# Altium project External_Camera_HAT.PrjPcb
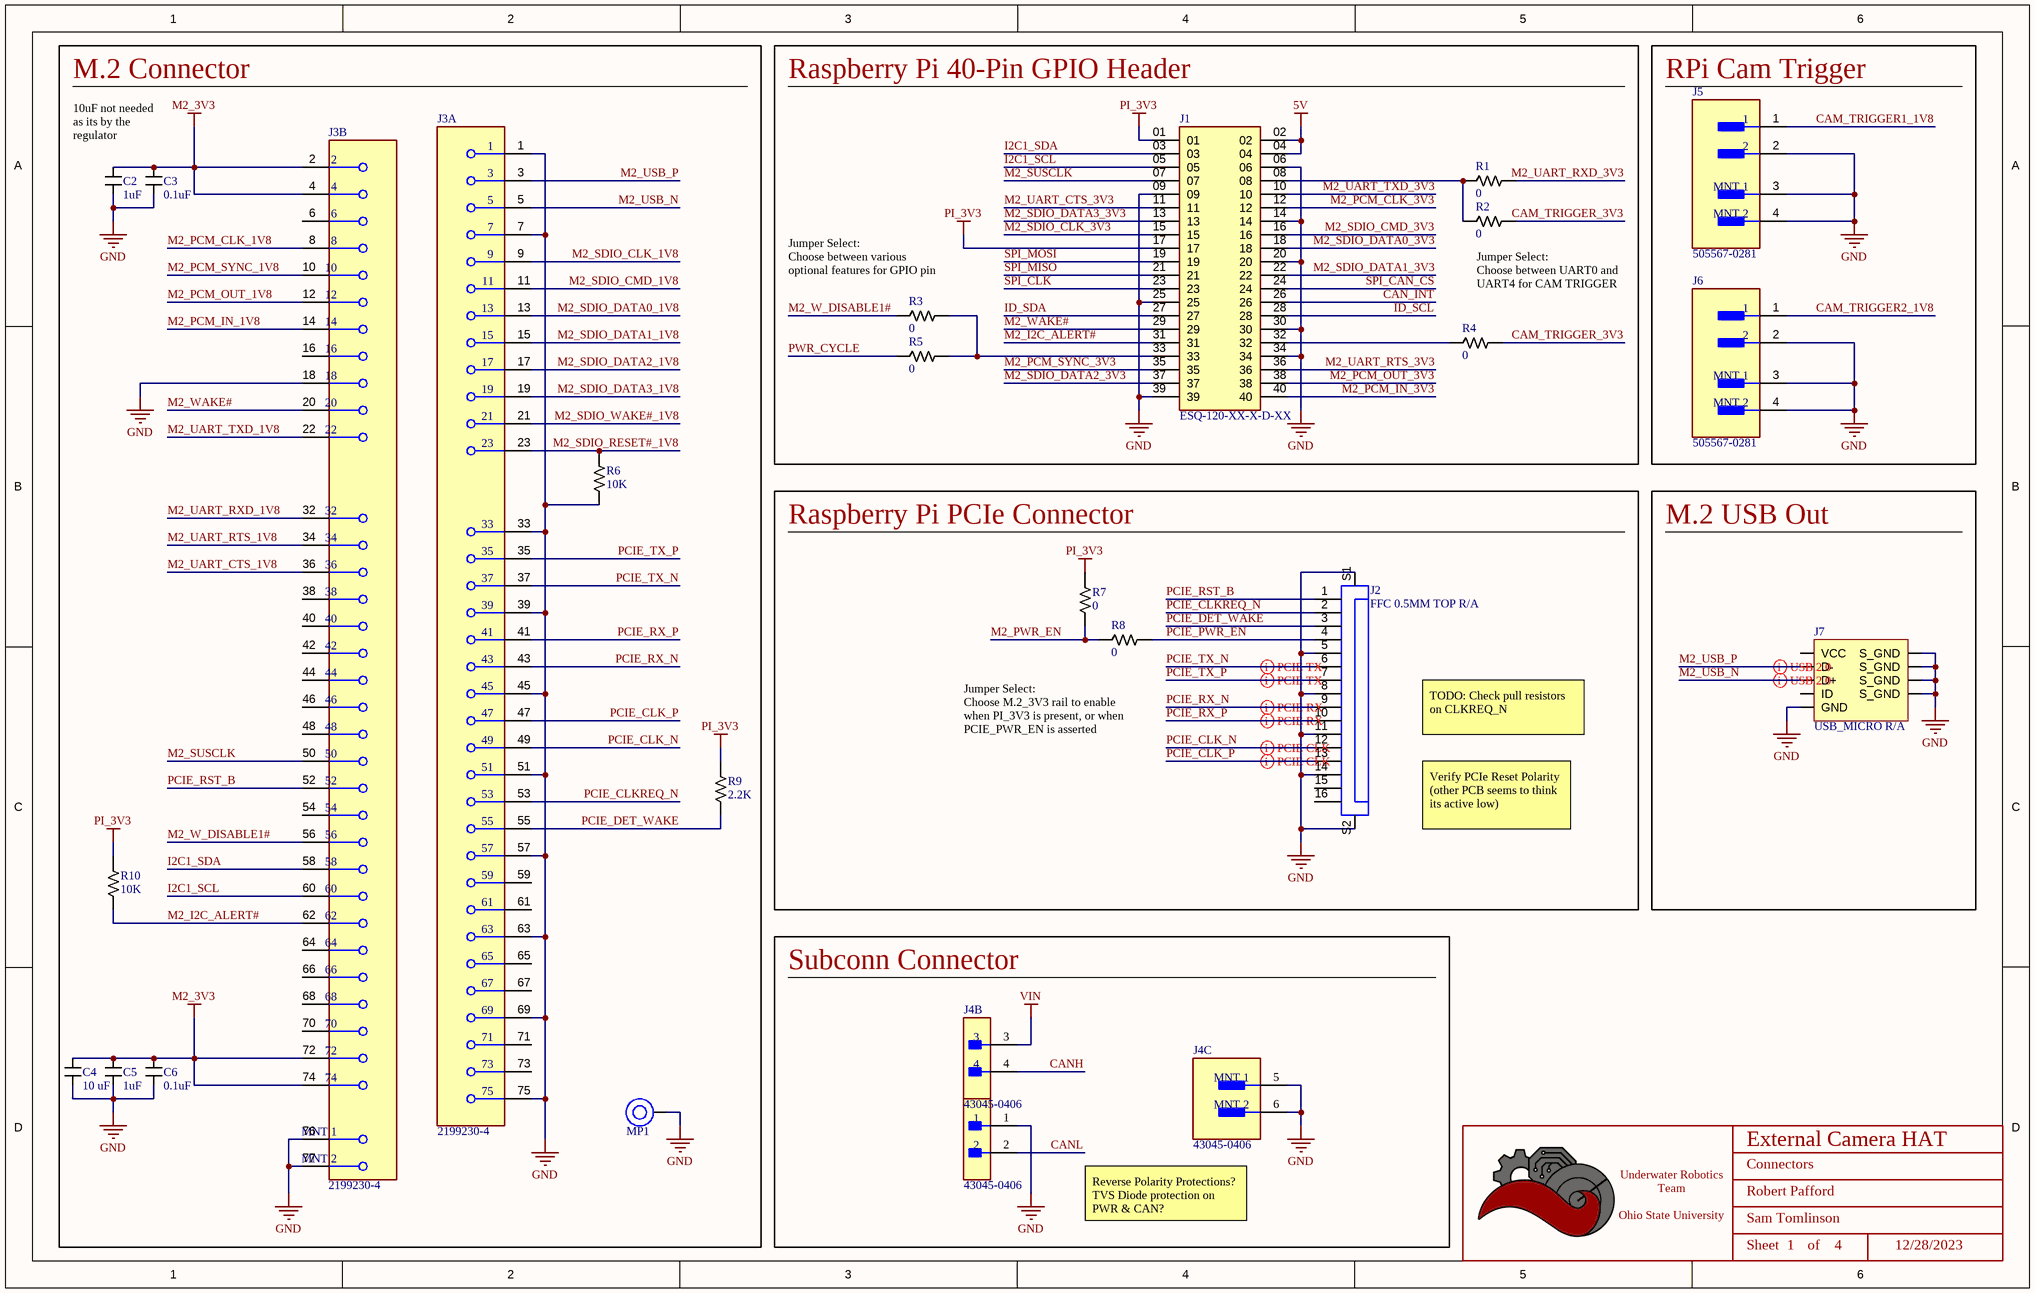
[diagram p0: External_Camera_HAT_Connectors.SchDoc]
BoardRevision: 1.0; DateOfDesignReview: XX/XX/XXXX; ProjectTitle: External Camera HAT; TeamLead: Sam Tomlinson
4 sheets, 127 parts. Net scope: global (net labels, ports and power ports of the same name join across sheets).
Board file: External_Camera_HAT.PcbDoc
Sheets:
  External_Camera_HAT_Connectors.SchDoc
  External_Camera_HAT_Regulators.SchDoc
  External_Camera_HAT_Peripherals.SchDoc
  External_Camera_HAT_LvlShifters.SchDoc

## Sheet External_Camera_HAT_Connectors.SchDoc: Connectors
size B; Date: 12/28/2023; Author: Robert Pafford; Organization: ORGANIZATION; Address1: ADDRESS 1; Address2: ADDRESS 2; Address3: ADDRESS 3; Address4: ADDRESS 4; Revision: -; SheetNumber: 1; SheetTotal: 4; ENG_APP_DATE: --/--/--; DSN_APP_DATE: --/--/--; CHK_APP_DATE: --/--/--

### Parts
(Parts that share a designator on the sheet are numbered #1, #2 ... from top to bottom, then left to right.)
*#1  Title_Block  [LOGO]  (value not drawn)  (graphical)
C2  value 1uF  [CAPACITOR_0402]  (hidden comment: 1uF Ceramic 16V)
C3  value 0.1uF  [CAPACITOR_0402]  (hidden comment: 100nF Ceramic 25V)
C4  Value (uF): 10 uF  [CAPACITOR_0603]  (hidden comment: 10uF Ceramic 6.3V)
C5  value 1uF  [CAPACITOR_0402]  (hidden comment: 1uF Ceramic 16V)
C6  value 0.1uF  [CAPACITOR_0402]  (hidden comment: 100nF Ceramic 25V)
J1  ESQ-120-XX-X-D-XX  [SAMTEC_ESQ-120-XX-X-D-XX]
J2  FFC 0.5MM TOP R/A  [FH12A-16S-0.5SH(55)]
J3  2199230-4  [FP-2199230-4-MFG]  (parts A,B of 2)
J4  43045-0406  [FP-43045-0406-MFG]  (parts A,B,C of 3)
J5  505567-0281  [FP-505567-0281-MFG]
J6  505567-0281  [FP-505567-0281-MFG]
J7  USB_MICRO R/A  [CONN_MINIUSB]
MP1  M3 x 2.5mm  [78614025360]  (value not drawn)
R1  Value  (Ohms): 0  [RESISTOR_0402]  (hidden comment: 0 Ohm 1% 1/16W)
R2  Value  (Ohms): 0  [RESISTOR_0402]  (hidden comment: 0 Ohm 1% 1/16W)
R3  Value  (Ohms): 0  [RESISTOR_0402]  (hidden comment: 0 Ohm 1% 1/16W)
R4  Value  (Ohms): 0  [RESISTOR_0402]  (hidden comment: 0 Ohm 1% 1/16W)
R5  Value  (Ohms): 0  [RESISTOR_0402]  (hidden comment: 0 Ohm 1% 1/16W)
R6  Value  (Ohms): 10K  [RESISTOR_0402]  (hidden comment: 10k Ohm 1% 1/16W)
R7  Value  (Ohms): 0  [RESISTOR_0402]  (hidden comment: 0 Ohm 1% 1/16W)
R8  Value  (Ohms): 0  [RESISTOR_0402]  (hidden comment: 0 Ohm 1% 1/16W)
R9  Value  (Ohms): 2.2K  [RESISTOR_0402]  (hidden comment: 2.2k Ohm 1% 1/16W)
R10  Value  (Ohms): 10K  [RESISTOR_0402]  (hidden comment: 10k Ohm 1% 1/16W)

### Blocks framed on the sheet
M.2 Connector: C2-C6 J3 MP1 R6 R9 R10
Raspberry Pi 40-Pin GPIO Header: J1 R1-R5
RPi Cam Trigger: J5 J6
Raspberry Pi PCIe Connector: J2 R7 R8
M.2 USB Out: J7
Subconn Connector: J4

### Nets
5V: J1.02 J1.04
GND: C2.2 C3.2 C4.2 C5.2 C6.2 J1.06 J1.09 J1.14 J1.20 J1.25 J1.30 J1.34 J1.39 J2.5 J2.8 J2.11 J2.14 J2.S1 J2.S2 J3.1 J3.7 J3.18 J3.33 J3.39 J3.45 J3.51 J3.57 J3.63 J3.69 J3.75 J3.76(MNT_1) J3.77(MNT_2) J4.1 J4.5(MNT_1) J4.6(MNT_2) J5.2 J5.3(MNT_1) J5.4(MNT_2) J6.2 J6.3(MNT_1) J6.4(MNT_2) J7.5(GND) J7.6(S_GND) J7.7(S_GND) J7.8(S_GND) J7.9(S_GND) MP1.1 R6.2
M2_3V3: C2.1 C3.1 C4.1 C5.1 C6.1 J3.2 J3.4 J3.72 J3.74
PI_3V3: J1.01 J1.17 R7.1 R9.1 R10.1
VIN: J4.3
CAM_TRIGGER1_1V8: J5.1
CAM_TRIGGER2_1V8: J6.1
CAM_TRIGGER_3V3: R2.1 R4.1
CAN_INT: J1.26
CANH: J4.4
CANL: J4.2
I2C1_SCL: J1.05 J3.60
I2C1_SDA: J1.03 J3.58
ID_SCL: J1.28
ID_SDA: J1.27
M2_I2C_ALERT#: J1.31 J3.62 R10.2
M2_PCM_CLK_1V8: J3.8
M2_PCM_CLK_3V3: J1.12
M2_PCM_IN_1V8: J3.14
M2_PCM_IN_3V3: J1.40
M2_PCM_OUT_1V8: J3.12
M2_PCM_OUT_3V3: J1.38
M2_PCM_SYNC_1V8: J3.10
M2_PCM_SYNC_3V3: J1.35
M2_PWR_EN: R7.2 R8.2
M2_SDIO_CLK_1V8: J3.9
M2_SDIO_CLK_3V3: J1.15
M2_SDIO_CMD_1V8: J3.11
M2_SDIO_CMD_3V3: J1.16
M2_SDIO_DATA0_1V8: J3.13
M2_SDIO_DATA0_3V3: J1.18
M2_SDIO_DATA1_1V8: J3.15
M2_SDIO_DATA1_3V3: J1.22
M2_SDIO_DATA2_1V8: J3.17
M2_SDIO_DATA2_3V3: J1.37
M2_SDIO_DATA3_1V8: J3.19
M2_SDIO_DATA3_3V3: J1.13
M2_SDIO_RESET#_1V8: J3.23 R6.1
M2_SDIO_WAKE#_1V8: J3.21
M2_SUSCLK: J1.07 J3.50
M2_UART_CTS_1V8: J3.36
M2_UART_CTS_3V3: J1.11
M2_UART_RTS_1V8: J3.34
M2_UART_RTS_3V3: J1.36
M2_UART_RXD_1V8: J3.32
M2_UART_RXD_3V3: R1.1
M2_UART_TXD_1V8: J3.22
M2_UART_TXD_3V3: J1.10
M2_USB_N: J3.5 J7.3(D+)
M2_USB_P: J3.3 J7.2(D-)
M2_W_DISABLE1#: J3.56 R3.2
M2_WAKE#: J1.29 J3.20
PCIE_CLK_N: J2.12 J3.49
PCIE_CLK_P: J2.13 J3.47
PCIE_CLKREQ_N: J2.2 J3.53
PCIE_DET_WAKE: J2.3 J3.55 R9.2
PCIE_PWR_EN: J2.4 R8.1
PCIE_RST_B: J2.1 J3.52
PCIE_RX_N: J2.9 J3.43
PCIE_RX_P: J2.10 J3.41
PCIE_TX_N: J2.6 J3.37
PCIE_TX_P: J2.7 J3.35
PWR_CYCLE: R5.2
SPI_CAN_CS: J1.24
SPI_CLK: J1.23
SPI_MISO: J1.21
SPI_MOSI: J1.19
NetJ1_08: J1.08 R1.2 R2.2
NetJ1_32: J1.32 R4.2
NetJ1_33: J1.33 R3.1 R5.1

Not connected (* = marked no-connect by the designer): J2 15 16; J3 6 16 38 40 42 44 46 48 54 59 61 64 65 66 67 68 70 71 73; J7 1(VCC) 4(ID)

### Layout directives
differential pair; differential pair class USB 2.0: M2_USB_N, M2_USB_P
differential pair; differential pair class PCIe Gen 2: PCIE_CLK_N, PCIE_CLK_P, PCIE_RX_N, PCIE_RX_P, PCIE_TX_N, PCIE_TX_P

### Notes on the sheet
- 10uF not needed as its by the regulator
- (near R3) Jumper Select:
  Choose between various optional features for GPIO pin
- Jumper Select:
  Choose between UART0 and UART4 for CAM TRIGGER
- (near R8) Jumper Select:
  Choose M.2_3V3 rail to enable when PI_3V3 is present, or when PCIE_PWR_EN is asserted
- TODO: Check pull resistors on CLKREQ_N
- Verify PCIe Reset Polarity (other PCB seems to think its active low)
- Reverse Polarity Protections?
  TVS Diode protection on PWR & CAN?
- DWG. NO.
- REV.
- SHT.
- THIS DOCUMENT AND THE DATA DISCLOSED HEREIN OR HEREWITH IS THE PROPERTY OF ALTIUM LIMITED AND MAY BE FREELY DISTRIBUTED IN WHOLE. NO RIGHTS ARE RESERVED OR EXPRESS OR IMPLIED WARANTEE GIVEN.
- REVISION
- DESCRIPTION
- DATE
- APPROVED
- ENG:
- APPROVALS
- PROJECT
- DSN:
- CHK:
- REFERENCE DOCUMENTS
- PROJECT REVISION:
- TITLE
- DOCUMENT REVISION:
- DESIGN ITEM:
- BOM:
- FAB DWG:
- PCB DWG:
- ASSY DWG:
- SCALE:
- SIZE
- B
- CAGE CODE
- FILE NAME
- DWG NO.
- SHEET
- OF
- REV
- (in symbol Title_Block) Underwater Robotics Team / Ohio State University; Sheet; of

### Library data of the parts
*#1 = Title_Block: UWRT Schematic Title Block Template / Created June 2021, Dylan Trainor
C2 C5 = CAPACITOR_1uF_0402: Cap 1uF 16V +/-10% / Ceramic 0402; Made By: Robert Pafford; Tolerance: +/- 10%; Voltage: 16V; Supplier 1: Digi-Key; Supplier Part Number 1: 478-0402YD105KAT4ADKR-ND
C3 C6 = CAPACITOR_0.1uF_0402: Cap 100nF 25V +/-10% / Ceramic 0402; Made By: Robert Pafford; Tolerance: +/- 10%; Voltage: 25V; Supplier 1: Digi-Key; Supplier Part Number 1: 478-7868-1-ND
C4 = CAPACITOR_10uF_0603: Cap 10uF 6.3V +/-20% / Ceramic 0603; Made By: Flip B; ComponentLink1Description: Digikey; ComponentLink1URL: https://www.digikey.com/en/products/detail/samsung-electro-mechanics/CL10A106MQ8NNNC/3886777; Supplier 1: Digi-Key; Supplier Part Number 1: 1276-1119-1-ND; Tolerance: +/- 20%; Voltage: 6.3V
J1 = ESQ-120-XX-X-D-XX: ESQ - Samtec 2.54mm Elevated Dual Row Socket Strip 7.36mm Contact. 11.05mm Profile (13); MP: ESQ-120-13-L-D; Price: None; Purchase-URL: https://pricing.snapeda.com/search/part/ESQ-120-13-L-D/?ref=eda; Package: None; Check_prices: https://www.snapeda.com/parts/ESQ-120-13-L-D/Samtec+Inc./view-part/?ref=eda; Value: *; Availability: In Stock; MF: Samtec; SnapEDA_Link: https://www.snapeda.com/parts/ESQ-120-13-L-D/Samtec+Inc./view-part/?ref=snap; Supplier 1: Digikey; Supplier Part Number 1: SAM9318-ND
J2 = FFC_16POS_0.5MM_R/A_TOP: 16 Position FPC Connector Contacts, Top 0.02" (0.5mm) Surface Mount, Right Angle, Gold Contacts; Made By: Robert Pafford; Max Current: 0.5A; FFC Type: ZIF Locking; Orientation: Top R/A; Pin Count: 16; Contact Plating: Gold; Supplier 1: Digi-Key; Supplier Part Number 1: HFK116CT-ND
J3 = CMP-03365-000002-1: CONN FEMALE 67POS 0.020 GOLD; Manufacturer: TE Connectivity; Conn Orientation: Right Angle; Pitch: 0.5mm; Number Of Contacts: 67; Voltage Rating: 50V; Is Female: yes; Current Rating: 0.5A; Lead Free: Yes; Temperature Range Low: -40°C; Device Class L3: unset; Package: 0; Manufacturer Part Number: 2199230-4; RoHS: TRUE; Digikey Description: CONN FEMALE 67POS 0.020 GOLD; Category: Conn; Device Class L1: Connectors; Temperature Range High: +80°C; ComponentLink2Description: Datasheet; ComponentLink2URL: https://www.te.com/commerce/DocumentDelivery/DDEController?Action=showdoc&DocId=Customer+Drawing%7F2199230%7FB3%7Fpdf%7FEnglish%7FENG_CD_2199230_B3.pdf%7F2199230-4; Mouser Description: PCI Express / PCI Connectors .5PITCH 4.2H KEY E EMBOSS NGFF MINICARD; Automotive: No; Conn Gender: Female; Height: 4.2mm; Device Class L2: Card Edge Connectors; Contact Material: Gold,Nickel; Number Of Rows: 2; Octopart: https://octopart.com/2199230-4-te+connectivity-46436156; Temperature: -40°C to +80°C
J4 = CMP-04776-000244-1: CONN HEADER SMD R/A 4POS 3MM; Max Voltage Rating (DC): 250.25kV; Contact Resistance: 10mR; Glow Wire Compliant: Compliant; Current Rating: 5A; Number of Contacts: 4; Gender: Male; Voltage Rating: 600V; Voltage Rating (DC): 250V; Min Operating Temperature: -40°C; Mount: Surface Mount; Contact Material: Brass; Number of Rows: 2; Flammability Rating: UL94 V-0; Series: Micro-Fit 3.0; Termination: SMD/SMT; Packaging: Tape and Reel; Row Spacing: 3mm; Contact Plating: Tin; Case/Package: 0406; Package Quantity: 1800; Number of Circuits: 4; Halogen Free: Low Halogen; Pitch: 3mm; Max Operating Temperature: 105°C; RoHS Compliant: Yes; Housing Material: Thermoplastic; Color: Black; Number of Positions: 4; Orientation: Right Angle
J5 J6 = CMP-04776-000725-1: CONN HEADER SMD R/A 2POS 1.25MM
J7 = CONN_MICROUSB: Amphenol Micro USB-B / USB2.0 5 Pin Right Angle SMD; Pitch: 0.65mm; Current Per Pin: 1.8A; Number of Positions: 5; Manufacturer: Amphenol; Configuration: Right Angle; Color: Silver; Created By: Flip B; ComponentLink1Description: Datasheet; ComponentLink1URL: https://cdn.amphenol-icc.com/media/wysiwyg/files/documentation/datasheet/inputoutput/io_usb_micro.pdf?__cf_chl_jschl_tk__=05693735e19256298f6ef6ca2bb2e65c376a4f56-1625503833-0-Abitsb0-ufjOXJYs_S3J3r2iTn-nObalbmXUksF1VvO_h_WEmRdMlUD1I8-hmWSEVWzY1pirKnrPZWfgY3851qyBZe5ZvnNQePLGIzUgdEIQBVUyW36RsbYpDLEWxJ4horD-5gChFgobLYqwmG5aHl0E8lIn_twwPPrOxilK2gP0q9t_CNOs_u5fMqXvXUrlsOv8tIE2NRlu6NVP8qtkL2GjhlkeTUbDMF8WvvpPDTFOgvZ4Y16Ej8F8AhWos88mo5B1HssXozw0XrkJQIqERITUu6rqloz9kf4ZzhBHtDAt-IkiAFY_Ds9SW8FYKKTtINJVpHZQ6Gyu1FFM4Dc9MO0maE8_mmNcwlxqyRoRk_MPWW8VyByXWM5RSp52jteRKw7FeI9WIYvCbPAOy0Eyib-aseIQsnGbglBcUY6_2xp8GYaJM38H3dNvBPsSOfJBPndKedwKHllxjkucXn6xsN0sDXkpGN-cu8_2bDTJ0g-uUucKSCooYX-ApSDNGpkA_p9zv1SOAD8c0zaZVmtiBsN75QpVz2rzq9_BFxOywPvR; Series: 10118192; Supplier 1: Digi-Key; Supplier Part Number 1: 609-4613-1-ND
MP1 = M3_STANDOFF_78614025360: WE-SMSA SMT Spacer Studs Automotive, OD 6mm, ID 4.2mm, M3 x 2.5mm; Manufacturer: Wurth Elektronik; Solder Cream Thickness Min: 150µm; Surface: Tin; Tightenning Torque Max: 0.5N*m; ComponentLink1Description: Website Link; ComponentLink1URL: https://www.we-online.com/redexpert/article/78614025360?ad; ComponentLink2Description: Datasheet Link; ComponentLink2URL: https://www.we-online.com/redexpert/spec/78614025360?ad; Manufacturer Part Number: 78614025360; Category: Assembly; Match Code: WE-SMSA; Mount: Surface Mount; Operating Temperature Max: 150°C; Operating Temperature Min: -55°C; Packaging: Tape and Reel; Height: 2.5mm; Inner Diameter: 4.2mm; Outer Diameter: 6mm; Material: Steel; Thread: M3; Supplier 1: Digikey; Supplier Part Number 1: 732-78614025360CT-ND
R1-R5 R7 R8 = RESISTOR_0_0402: RES 0 OHM 1% 1/16W 0402; Tolerance: +/- 1%; Made By: Robert Pafford; Wattage: 1/16W; Supplier 1: Digikey; Supplier Part Number 1: 13-AC0402FR-070RLCT-ND
R6 R10 = RESISTOR_10K_0402: RES 10k OHM 1% 1/16W 0402; Tolerance: +/- 1%; Made By: Robert Pafford; Wattage: 1/16W; Supplier: Digikey; Digikey Part Numer: CR0603-JW-104ELFTR-ND; Supplier 1: Digi-Key; Supplier Part Number 1: YAG3436CT-ND
R9 = RESISTOR_2.2K_0402: RES 2.2K OHM 1% 1/16W 0402; Tolerance: +/- 1%; Made By: Megan McCabe; Wattage: 1/16W; Supplier 1: Digikey; Supplier Part Number 1: 311-2.20KLRCT-ND

## Sheet External_Camera_HAT_Regulators.SchDoc: Regulators
size B; Date: 1/16/2024; Author: Robert Pafford; Organization: ORGANIZATION; Address1: ADDRESS 1; Address2: ADDRESS 2; Address3: ADDRESS 3; Address4: ADDRESS 4; Revision: -; SheetNumber: 2; SheetTotal: 4; ENG_APP_DATE: --/--/--; DSN_APP_DATE: --/--/--; CHK_APP_DATE: --/--/--
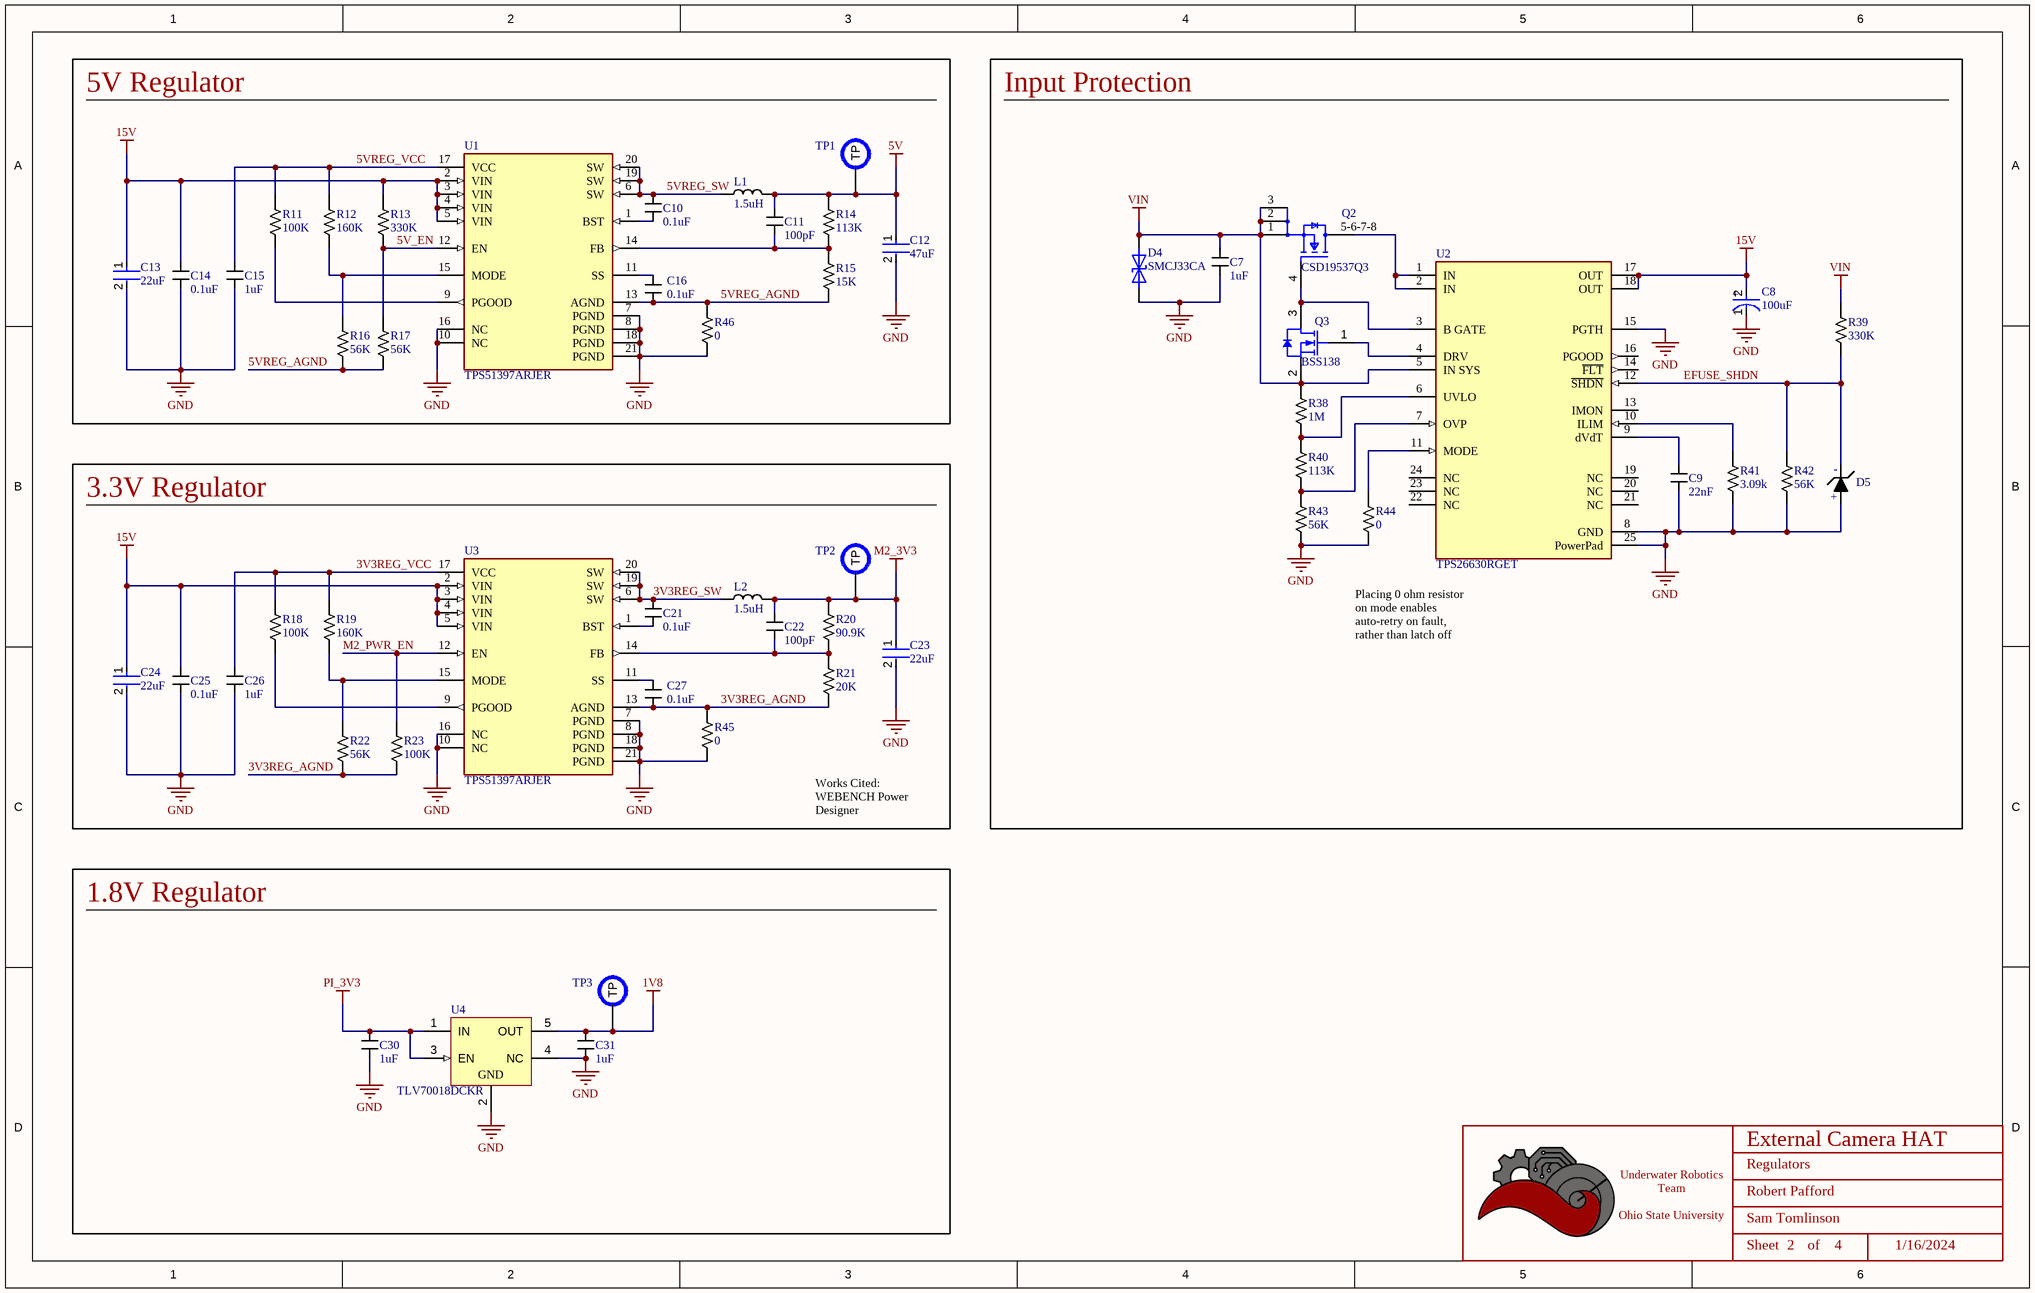
[diagram p1: External_Camera_HAT_Regulators.SchDoc]

### Parts
(Parts that share a designator on the sheet are numbered #1, #2 ... from top to bottom, then left to right.)
*#2  Title_Block  [LOGO]  (value not drawn)  (graphical)
C7  value 1uF  [CAPACITOR_0603]  (hidden comment: 1uF Ceramic 25V)
C8  100uF  [FP-UWT1H101MNL1GS-MFG]
C9  value 22nF  [CAPACITOR_0402]  (hidden comment: 22nF Ceramic 25V)
C10  value 0.1uF  [CAPACITOR_0402]  (hidden comment: 100nF Ceramic 25V)
C11  value 100pF  [CAPACITOR_0402]  (hidden comment: 100pF Ceramic 25V)
C12  Capacitance: 47uF  [FP-GRM31C-0_2-e0_3_0_8-MFG]  (hidden comment: GRM31CR61A476KE15L)
C13  Capacitance: 22uF  [FP-C2012-125-0_2-MFG]  (hidden comment: C2012X5R1V226M125AC)
C14  value 0.1uF  [CAPACITOR_0402]  (hidden comment: 100nF Ceramic 25V)
C15  value 1uF  [CAPACITOR_0402]  (hidden comment: 1uF Ceramic 16V)
C16  value 0.1uF  [CAPACITOR_0402]  (hidden comment: 100nF Ceramic 25V)
C21  value 0.1uF  [CAPACITOR_0402]  (hidden comment: 100nF Ceramic 25V)
C22  value 100pF  [CAPACITOR_0402]  (hidden comment: 100pF Ceramic 25V)
C23  Capacitance: 22uF  [FP-C2012-125-0_2-MFG]  (hidden comment: C2012X5R1V226M125AC)
C24  Capacitance: 22uF  [FP-C2012-125-0_2-MFG]  (hidden comment: C2012X5R1V226M125AC)
C25  value 0.1uF  [CAPACITOR_0402]  (hidden comment: 100nF Ceramic 25V)
C26  value 1uF  [CAPACITOR_0402]  (hidden comment: 1uF Ceramic 16V)
C27  value 0.1uF  [CAPACITOR_0402]  (hidden comment: 100nF Ceramic 25V)
C30  value 1uF  [CAPACITOR_0402]  (hidden comment: 1uF Ceramic 16V)
C31  value 1uF  [CAPACITOR_0402]  (hidden comment: 1uF Ceramic 16V)
D4  SMCJ33CA  [DIOM7959X262N]
D5  Zener_Diode_3.3V_250mW_1  [SOD-123]  (value not drawn)
L1  value 1.5uH  [IHLP2525EZ]  (hidden comment: 1.5uH Shielded)
L2  value 1.5uH  [IHLP2525EZ]  (hidden comment: 1.5uH Shielded)
Q2  CSD19537Q3  [FP-DQG0008A-MFG]
Q3  BSS138  [FAIR-SOT23-3_V]
R11  Value  (Ohms): 100K  [RESISTOR_0402]  (hidden comment: 100k Ohm 1% 1/16W)
R12  Value  (Ohms): 160K  [RESISTOR_0402]  (hidden comment: 160k Ohm 1% 1/16W)
R13  Value  (Ohms): 330K  [RESISTOR_0402]  (hidden comment: 330k Ohm 1% 1/16W)
R14  Value  (Ohms): 113K  [RESISTOR_0402]  (hidden comment: 113k Ohm 1% 1/16W)
R15  Value  (Ohms): 15K  [RESISTOR_0402]  (hidden comment: 15k Ohm 1% 1/16W)
R16  Value  (Ohms): 56K  [RESISTOR_0402]  (hidden comment: 56k Ohm 1% 1/16W)
R17  Value  (Ohms): 56K  [RESISTOR_0402]  (hidden comment: 56k Ohm 1% 1/16W)
R18  Value  (Ohms): 100K  [RESISTOR_0402]  (hidden comment: 100k Ohm 1% 1/16W)
R19  Value  (Ohms): 160K  [RESISTOR_0402]  (hidden comment: 160k Ohm 1% 1/16W)
R20  Value  (Ohms): 90.9K  [RESISTOR_0402]  (hidden comment: 90.9k Ohm 1% 1/16W)
R21  Value  (Ohms): 20K  [RESISTOR_0402]  (hidden comment: 20k Ohm 1% 1/16W)
R22  Value  (Ohms): 56K  [RESISTOR_0402]  (hidden comment: 56k Ohm 1% 1/16W)
R23  Value  (Ohms): 100K  [RESISTOR_0402]  (hidden comment: 100k Ohm 1% 1/16W)
R38  Value  (Ohms): 1M  [RESISTOR_0402]  (hidden comment: 1M Ohm 1% 1/16W)
R39  Value  (Ohms): 330K  [RESISTOR_0402]  (hidden comment: 330k Ohm 1% 1/16W)
R40  Value  (Ohms): 113K  [RESISTOR_0402]  (hidden comment: 113k Ohm 1% 1/16W)
R41  Value  (Ohms): 3.09k  [RESISTOR_0402]  (hidden comment: 3.09k Ohm 1% 1/16W)
R42  Value  (Ohms): 56K  [RESISTOR_0402]  (hidden comment: 56k Ohm 1% 1/16W)
R43  Value  (Ohms): 56K  [RESISTOR_0402]  (hidden comment: 56k Ohm 1% 1/16W)
R44  Value  (Ohms): 0  [RESISTOR_0402]  (hidden comment: 0 Ohm 1% 1/16W)
R45  Value  (Ohms): 0  [RESISTOR_0402]  (hidden comment: 0 Ohm 1% 1/16W)
R46  Value  (Ohms): 0  [RESISTOR_0402]  (hidden comment: 0 Ohm 1% 1/16W)
TP1  PCB Test Point  [TESTPOINT_1.2MM]  (value not drawn)  (no BOM)
TP2  PCB Test Point  [TESTPOINT_1.2MM]  (value not drawn)  (no BOM)
TP3  PCB Test Point  [TESTPOINT_1.2MM]  (value not drawn)  (no BOM)
U1  TPS51397ARJER  [FP-RJE0020B-MFG]
U2  TPS26630RGET  [FP-RGE0024H-MFG]
U3  TPS51397ARJER  [FP-RJE0020B-MFG]
U4  TLV70018DCKR  [DCK0005A_N]

### Blocks framed on the sheet
5V Regulator: C10-C16 L1 R11-R17 R46 TP1 U1
Input Protection: C7-C9 D4 D5 Q2 Q3 R38-R44 U2
3.3V Regulator: C21-C27 L2 R18-R23 R45 TP2 U3
1.8V Regulator: C30 C31 TP3 U4

### Nets
1V8: C31.1 TP3.TP U4.5(OUT)
5V: C11.1 C12.1 L1.1 R14.1 TP1.TP
15V: C8.2(A) C13.1 C14.1 C24.1 C25.1 R13.1 U1.2(VIN) U1.3(VIN) U1.4(VIN) U1.5(VIN) U2.17(OUT) U2.18(OUT) U3.2(VIN) U3.3(VIN) U3.4(VIN) U3.5(VIN)
GND: C7.2 C8.1(C) C9.2 C12.2 C13.2 C14.2 C15.2 C23.2 C24.2 C25.2 C26.2 C30.2 C31.2 D4.1 D5.1 R41.2 R42.2 R43.2 R44.2 R45.2 R46.2 U1.7(PGND) U1.8(PGND) U1.10(NC) U1.16(NC) U1.18(PGND) U1.21(PGND) U2.8(GND) U2.15(PGTH) U2.25(PowerPad) U3.7(PGND) U3.8(PGND) U3.10(NC) U3.16(NC) U3.18(PGND) U3.21(PGND) U4.2(GND) U4.4(NC)
M2_3V3: C22.1 C23.1 L2.1 R20.1 TP2.TP
PI_3V3: C30.1 U4.1(IN) U4.3(EN)
VIN: C7.1 D4.2 Q2.1(S) Q2.2(S) Q2.3(S) Q3.2(S) R38.1 R39.1 U2.5(IN_SYS)
3V3REG_AGND: C27.2 R21.2 R22.2 R23.2 R45.1 U3.13(AGND)
3V3REG_SW: C21.1 L2.2 U3.6(SW) U3.19(SW) U3.20(SW)
3V3REG_VCC: C26.1 R18.1 R19.1 U3.17(VCC)
5V_EN: R13.2 R17.1 U1.12(EN)
5VREG_AGND: C16.2 R15.2 R16.2 R17.2 R46.1 U1.13(AGND)
5VREG_SW: C10.1 L1.2 U1.6(SW) U1.19(SW) U1.20(SW)
5VREG_VCC: C15.1 R11.1 R12.1 U1.17(VCC)
EFUSE_SHDN: D5.2 R39.2 R42.1 U2.12(~{SHDN})
M2_PWR_EN: R23.1 U3.12(EN)
NetC9_1: C9.1 U2.9(dVdT)
NetC10_2: C10.2 U1.1(BST)
NetC11_2: C11.2 R14.2 R15.1 U1.14(FB)
NetC16_1: C16.1 U1.11(SS)
NetC21_2: C21.2 U3.1(BST)
NetC22_2: C22.2 R20.2 R21.1 U3.14(FB)
NetC27_1: C27.1 U3.11(SS)
NetQ2_4: Q2.4(G) Q3.3(D) U2.3(B_GATE)
NetQ2_5-6-7-8: Q2.5-6-7-8(D) U2.1(IN) U2.2(IN)
NetQ3_1: Q3.1(G) U2.4(DRV)
NetR11_2: R11.2 U1.9(PGOOD)
NetR12_2: R12.2 R16.1 U1.15(MODE)
NetR18_2: R18.2 U3.9(PGOOD)
NetR19_2: R19.2 R22.1 U3.15(MODE)
NetR38_2: R38.2 R40.1 U2.6(UVLO)
NetR40_2: R40.2 R43.1 U2.7(OVP)
NetR41_1: R41.1 U2.10(ILIM)
NetR44_1: R44.1 U2.11(MODE)

Not connected (* = marked no-connect by the designer): U2 13(IMON) 14(~{FLT}) 16(PGOOD) 19(NC) 20(NC) 21(NC) 22(NC) 23(NC) 24(NC)

### Notes on the sheet
- Placing 0 ohm resistor on mode enables auto-retry on fault, rather than latch off
- Works Cited:
  WEBENCH Power Designer
- DWG. NO.
- REV.
- SHT.
- THIS DOCUMENT AND THE DATA DISCLOSED HEREIN OR HEREWITH IS THE PROPERTY OF ALTIUM LIMITED AND MAY BE FREELY DISTRIBUTED IN WHOLE. NO RIGHTS ARE RESERVED OR EXPRESS OR IMPLIED WARANTEE GIVEN.
- REVISION
- DESCRIPTION
- DATE
- APPROVED
- ENG:
- APPROVALS
- PROJECT
- DSN:
- CHK:
- REFERENCE DOCUMENTS
- PROJECT REVISION:
- TITLE
- DOCUMENT REVISION:
- DESIGN ITEM:
- BOM:
- FAB DWG:
- PCB DWG:
- ASSY DWG:
- SCALE:
- SIZE
- B
- CAGE CODE
- FILE NAME
- DWG NO.
- SHEET
- OF
- REV
- (in symbol CMP-2000-07373-2) +
- (in symbol Title_Block) Underwater Robotics Team / Ohio State University; Sheet; of
- (in symbol Zener_Diode_3.3V_250mW_1) -; +

### Library data of the parts
*#2 = Title_Block: as *#1 on sheet External_Camera_HAT_Connectors
C7 = CAPACITOR_1uF_0603_25V: Cap 1uF 25V +/-10% / Ceramic 0603; Voltage: 16V; Made By: Flip B; Tolerance: +/- 10%; Supplier 1: Digikey; Supplier Part Number 1: 1276-1102-1-ND
C8 = CMP-2000-07373-2: CAP ALUM 100UF 20% 50V SMD; Leakage Current: 3uA; Ripple Current: 140mA; Life (Hours): 1000Hour; Dissipation Factor: 0.14%; Dielectric Material: Aluminium; Termination: SMD/SMT; Tolerance: 20%; Package Quantity: 500; Capacitance: 100uF; Height: 10mm; REACH SVHC: No SVHC; Case/Package: Radial; Series: WT; Diameter: 8mm; Voltage Rating: 50V; Construction: Cylindrical; Length: 10mm; Min Operating Temperature: -55°C; Max Operating Temperature: 105°C; Voltage Rating (DC): 50V; Packaging: Tape and Reel; Voltage: 50V; Mount: Surface Mount; Ripple Current (AC): 140mA; Radiation Hardening: No; Number of Pins: 2; Lead Free: Lead Free; Height - Seated (Max): 0.413inch; RoHS Compliant: Yes
C9 = CAPACITOR_0.022uF_0402: Cap 22nF 25V +/-10% / Ceramic 0402; Made By: Robert Pafford; Tolerance: +/- 10%; Voltage: 25V; Supplier 1: Digi-Key; Supplier Part Number 1: 445-1261-1-ND
C10 C14 C16 C21 C25 C27 = CAPACITOR_0.1uF_0402: as C3 on sheet External_Camera_HAT_Connectors; Tolerance: +/- 10%; Voltage: 25V; Supplier 1: Digi-Key; Supplier Part Number 1: 478-7868-1-ND
C11 C22 = CAPACITOR_0.0001uF_0402: Cap 100pF 25V +/-10% / Ceramic 0402; Made By: Robert Pafford; Tolerance: +/- 10%; Voltage: 25V; Supplier 1: Digikey; Supplier Part Number 1: 399-C0402C101K3GAC7867CT-ND
C12 = CMP-06035-015661-1: Chip Multilayer Ceramic Capacitors for General Purpose, 1206, 47uF, X5R, 15%, 10%, 10V; Case/Package: 1206; Min Operating Temperature: -55°C; REACH SVHC: No SVHC; Mount: Surface Mount; Height: 1.6mm; Thickness: 0.071inch; Packaging: Tape and Reel; Tolerance: 10%; Dielectric: X5R; Case Code (Imperial): 1206; Lead Free: Lead Free; Width: 1.6mm; Voltage Rating (DC): 10V; Material: Ceramic; Max Operating Temperature: 85°C; Voltage: 10V; Package Quantity: 2000; Case Code (Metric): 3216; Termination: SMD/SMT; Voltage Rating: 10V; Depth: 1.6mm; Length: 3.2mm
C13 C23 C24 = CMP-2000-06038-3: Multilayer Ceramic Capacitors 22μF ±20% 35V X5R SMD 0805; Tolerance: 20%; RoHS Compliant: Yes; Height: 1.25mm; Termination: SMD/SMT; Case/Package: 0805; Thickness: 0.057inch; Max Operating Temperature: 85°C; Min Operating Temperature: -55°C; Voltage Rating (DC): 35V; Length: 0.079inch; Dielectric: X5R; Dielectric Material: Ceramic; Voltage Rating: 35V; Mount: Surface Mount; Package Quantity: 2000; Lead Free: Lead Free; Weight: 0.000194oz; REACH SVHC: No SVHC; Width: 0.049inch; Packaging: Tape and Reel; Series: C; Case Code (Metric): 2012; Case Code (Imperial): 0805
C15 C26 C30 C31 = CAPACITOR_1uF_0402: as C2 on sheet External_Camera_HAT_Connectors; Tolerance: +/- 10%; Voltage: 16V; Supplier 1: Digi-Key; Supplier Part Number 1: 478-0402YD105KAT4ADKR-ND
D4 = SMCJ33CA: 53.3V Clamp 28.1A Ipp Tvs Diode Surface Mount SMC (DO-214AB); MF: Bourns Inc.; Price: None; SnapEDA_Link: https://www.snapeda.com/parts/SMCJ33CA/Bourns/view-part/4833712/?ref=snap; Arrow_Electronics-Purchase-URL: https://snapeda.com/shop?store=Arrow+Electronics&id=4833712; Availability: Good; Mouser-Purchase-URL: https://snapeda.com/shop?store=Mouser&id=4833712; MP: SMCJ33CA; Value: *; DigiKey-Purchase-URL: https://snapeda.com/shop?store=DigiKey&id=4833712; Package: None; Supplier 1: Digikey; Supplier Part Number 1: SMCJ33CABCT-ND
D5 = Zener_Diode_3.3V_250mW_1: Zener Diode | 3.3 V | 250 mW | SOT-23; Made By: Nathan A; Voltage - Zener: 10V; Power: 410mW; Package: SOD-123; ComponentLink1Description: Datasheet; ComponentLink1URL: https://www.panjit.com.tw/upload/datasheet/BZT52-C2V4_SERIES.pdf; Supplier 1: Digikey; Supplier Part Number 1: MMSZ4684T1GOSCT-ND
L1 L2 = INDUCTOR_1.5uH_IHLP2525EZ_1: Inductor Shielded 1.5uH 12A +/-20%; Made By: Robert Pafford; DC Resistance: 9mOhm; Tolerance: +/- 20%; Current Rating: 12A; Supplier 1: Digikey; Supplier Part Number 1: 541-4344-1-ND
Q2 = CMP-04962-000024-1: MOSFET N-CH 100V 50A 8VSON; Max Power Dissipation: 2.8W; Turn-On Delay Time: 5ns; Gate to Source Voltage (Vgs): 20V; Input Capacitance: 1.68nF; Rds On Max: 14.5mR; Fall Time: 3ns; Turn-Off Delay Time: 10ns; Continuous Drain Current (ID): 50A; Lead Free: Contains Lead; Mount: Surface Mount; Number of Pins: 8; Min Operating Temperature: -55°C; Packaging: Rail/Tube; Rise Time: 3ns; Contact Plating: Copper; RoHS Compliant: Yes; Drain to Source Voltage (Vdss): 100V; Max Operating Temperature: 150°C
Q3 = CMP-013-00021-4: N-Channel Logic Level Enhancement Mode Field Effect Transistor, 220 mA, 50 V, -55 to 150 degC, 3-Pin SOT-23, RoHS, Tape and Reel; Manufacturer: Fairchild; Elements: 1; Nominal Vgs: 1.3V; Resistance: 0.7Ohm; Typical Rise Time: 9ns; Rds On Max: 3.5Ohm; Nominal Dual Supply Voltage: 50V; Input Capacitance: 27pF; Package Version: Rev. 12, 03/2016; Power: 360mW; Packaging: TapeandReel; Package Description: 3-Pin Small Outline Transistor, Body 2.92 x 1.325 mm, Pitch 0.95 mm; Datasheet URL: https://www.fairchildsemi.com/datasheets/BS/BSS138.pdf; Min Operating Temperature: -55°C; Pins: 3; RoHS Compliant: True; Package Reference: SOT23-3; Package Quantity: 1; Case/Package: TO-236-3; Mounting Technology: SM; Max Operating Temperature: 150°C; Datasheet Version: Rev. C, 10/2005
R11 R18 R23 = RESISTOR_100K_0402: RES 100k OHM 1% 1/16W 0402; Tolerance: +/- 1%; Made By: Robert Pafford; Wattage: 1/16W; Supplier 1: Digikey; Supplier Part Number 1: YAG3434CT-ND
R12 R19 = RESISTOR_160K_0402: RES 160k OHM 1% 1/16W 0402; Tolerance: +/- 1%; Made By: Robert Pafford; Wattage: 1/16W; Supplier 1: Digikey; Supplier Part Number 1: YAG2996CT-ND
R13 R39 = RESISTOR_330K_0402: RES 330k OHM 1% 1/16W 0402; Tolerance: +/- 1%; Made By: Robert Pafford; Wattage: 1/16W; Supplier 1: Digikey; Supplier Part Number 1: 311-330KLRCT-ND
R14 R40 = RESISTOR_113K_0402: RES 113k OHM 1% 1/16W 0402; Tolerance: +/- 1%; Made By: Robert Pafford; Wattage: 1/16W; Supplier 1: Digikey; Supplier Part Number 1: YAG2368CT-ND
R15 = RESISTOR_15K_0402: RES 15k OHM 1% 1/16W 0402; Tolerance: +/- 1%; Made By: Robert Pafford; Wattage: 1/16W; Supplier 1: Digikey; Supplier Part Number 1: 311-15.0KLRCT-ND
R16 R17 R22 R42 R43 = RESISTOR_56K_0402: RES 56k OHM 1% 1/16W 0402; Tolerance: +/- 1%; Made By: Robert Pafford; Wattage: 1/16W; Supplier 1: Digi-Key; Supplier Part Number 1: YAG3501CT-ND
R20 = RESISTOR_90.9K_0402: RES 90.9k OHM 1% 1/16W 0402; Tolerance: +/- 1%; Made By: Robert Pafford; Wattage: 1/16W; Supplier 1: Digikey; Supplier Part Number 1: YAG5314CT-ND
R21 = RESISTOR_20K_0402: RES 20k OHM 1% 1/16W 0402; Tolerance: +/- 1%; Made By: Robert Pafford; Wattage: 1/16W; Supplier 1: Digikey; Supplier Part Number 1: YAG3454CT-ND
R38 = RESISTOR_1M_0402: RES 1M OHM 1% 1/16W 0402; Tolerance: +/- 1%; Made By: Robert Pafford; Wattage: 1/16W; Supplier 1: Digikey; Supplier Part Number 1: YAG3450CT-ND
R41 = RESISTOR_3.09K_0402: RES 3.09k OHM 1% 1/16W 0402; Tolerance: +/- 1%; Made By: Robert Pafford; Wattage: 1/16W; Supplier 1: Digikey; Supplier Part Number 1: 13-AC0402FR-073K09LCT-ND
R44-R46 = RESISTOR_0_0402: as R1 on sheet External_Camera_HAT_Connectors; Wattage: 1/16W; Supplier 1: Digikey; Supplier Part Number 1: 13-AC0402FR-070RLCT-ND
TP1-TP3 = TESTPOINT: Made By: Robert Pafford
U1 U3 = CMP-04918-000702-1: 10-A SYNCHRONOUS STEP-DOWN REGUL
U2 = CMP-04910-000050-1: POWER MANAGEMENT; RoHS Compliant: Yes
U4 = CMP-0394-00928-2: Single Output LDO, 200 mA, Fixed 1.8 V Output, 2 to 5.5 V Input, with Low IQ, 5-pin SC70 (DCK), -40 to 125 degC, Green (RoHS & no Sb/Br); Manufacturer: Texas Instruments; Vout Adj(Max)(V): 1.8; Vin(Max)(V): 5.5; SubFamily: Single Channel LDO; Iout(Max)(A): 0.2; Iq(Typ)(mA): 0.03; Accuracy(%): 2; Vdo(Typ)(mV): 175; PartNumber: TLV70018DCKR; ComponentLink3URL: http://www.ti.com/litv/pdf/mpds025f; ComponentLink1URL: http://www.ti.com/; PackageDescription: 5-Pin Plastic Small-Outline, Body 2 x 1.25 mm, Pitch 0.65 mm; DatasheetVersion: SLVSA00D; Eco-Plan: Green (RoHS & no Sb/Br); Mounting Technology: Surface Mount; ComponentLink2URL: http://www.ti.com/general/docs/lit/getliterature.tsp?genericPartNumber=TLV70018&fileType=pdf; ComponentLink3Description: Package Specification; Vout Adj(Min)(V): 1.8; ComponentLink1Description: Manufacturer URL; Code_JEDEC: MO-203; PackageReference: DCK0005A; ComponentLink2Description: Datasheet; Vin(Min)(V): 2; PackageVersion: 4093553-3/G; Fixed Output Options(V): 1.8

## Sheet External_Camera_HAT_Peripherals.SchDoc: Peripherals
size B; Date: 1/18/2024; Author: Robert Pafford; Organization: ORGANIZATION; Address1: ADDRESS 1; Address2: ADDRESS 2; Address3: ADDRESS 3; Address4: ADDRESS 4; Revision: -; SheetNumber: 3; SheetTotal: 4; ENG_APP_DATE: --/--/--; DSN_APP_DATE: --/--/--; CHK_APP_DATE: --/--/--
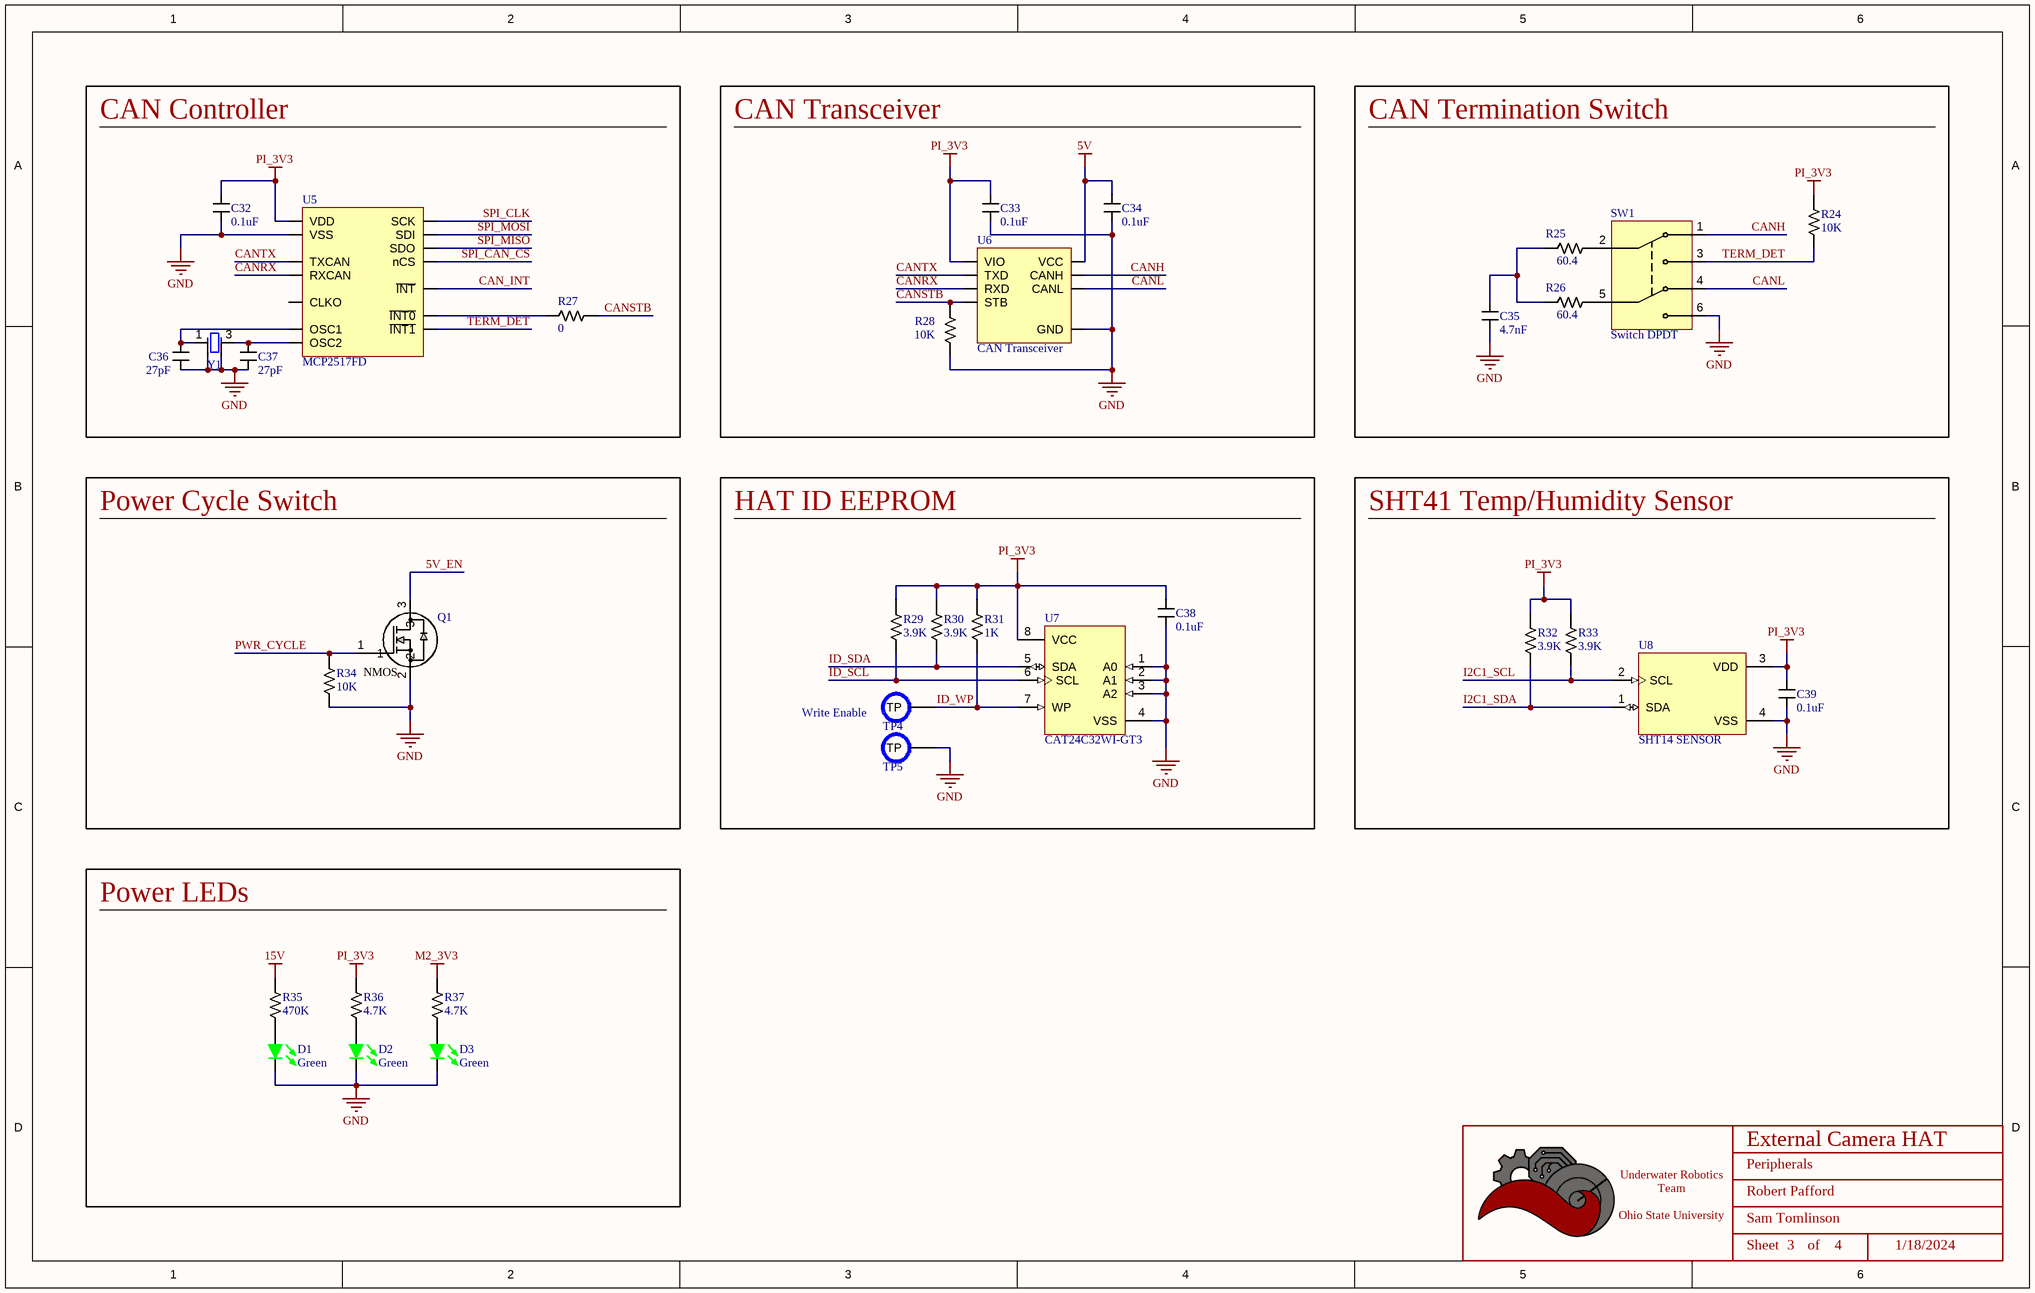
[diagram p2: External_Camera_HAT_Peripherals.SchDoc]

### Parts
(Parts that share a designator on the sheet are numbered #1, #2 ... from top to bottom, then left to right.)
*#3  Title_Block  [LOGO]  (value not drawn)  (graphical)
C32  value 0.1uF  [CAPACITOR_0402]  (hidden comment: 100nF Ceramic 25V)
C33  value 0.1uF  [CAPACITOR_0402]  (hidden comment: 100nF Ceramic 25V)
C34  value 0.1uF  [CAPACITOR_0402]  (hidden comment: 100nF Ceramic 25V)
C35  value 4.7nF  [CAPACITOR_0402]  (hidden comment: 4700pF Ceramic 25V)
C36  value 27pF  [CAPACITOR_0402]  (hidden comment: 27pF Ceramic 50V)
C37  value 27pF  [CAPACITOR_0402]  (hidden comment: 27pF Ceramic 50V)
C38  value 0.1uF  [CAPACITOR_0402]  (hidden comment: 100nF Ceramic 25V)
C39  value 0.1uF  [CAPACITOR_0402]  (hidden comment: 100nF Ceramic 25V)
D1  Color: Green  [LED_0603]  (hidden comment: 150060GS75000)
D2  Color: Green  [LED_0603]  (hidden comment: 150060GS75000)
D3  Color: Green  [LED_0603]  (hidden comment: 150060GS75000)
Q1  MOSFET N-CH 30V 5.8A SOT-23-3  [SOT-23-3]  (value not drawn)
R24  Value  (Ohms): 10K  [RESISTOR_0402]  (hidden comment: 10k Ohm 1% 1/16W)
R25  Value  (Ohms): 60.4  [RESISTOR_0402]  (hidden comment: 60.4 Ohm 1% 1/16W)
R26  Value  (Ohms): 60.4  [RESISTOR_0402]  (hidden comment: 60.4 Ohm 1% 1/16W)
R27  Value  (Ohms): 0  [RESISTOR_0402]  (hidden comment: 0 Ohm 1% 1/16W)
R28  Value  (Ohms): 10K  [RESISTOR_0402]  (hidden comment: 10k Ohm 1% 1/16W)
R29  Value  (Ohms): 3.9K  [RESISTOR_0402]  (hidden comment: 3.9k Ohm 1% 1/16W)
R30  Value  (Ohms): 3.9K  [RESISTOR_0402]  (hidden comment: 3.9k Ohm 1% 1/16W)
R31  Value  (Ohms): 1K  [RESISTOR_0402]  (hidden comment: 1k Ohm 1% 1/16W)
R32  Value  (Ohms): 3.9K  [RESISTOR_0402]  (hidden comment: 3.9k Ohm 1% 1/16W)
R33  Value  (Ohms): 3.9K  [RESISTOR_0402]  (hidden comment: 3.9k Ohm 1% 1/16W)
R34  Value  (Ohms): 10K  [RESISTOR_0402]  (hidden comment: 10k Ohm 1% 1/16W)
R35  Value  (Ohms): 470K  [RESISTOR_0603]  (hidden comment: 470k Ohm 5% 1/10W)
R36  Value  (Ohms): 4.7K  [RESISTOR_0603]  (hidden comment: 4.7k Ohm 5% 1/10W)
R37  Value  (Ohms): 4.7K  [RESISTOR_0603]  (hidden comment: 4.7k Ohm 5% 1/10W)
SW1  Switch DPDT  [CAS-220TA]
TP4  Write Enable  [TESTPOINT_1.2MM]  (no BOM)
TP5  PCB Test Point  [TESTPOINT_1.2MM]  (value not drawn)  (no BOM)
U5  MCP2517FD  [SOIC-14]
U6  CAN Transceiver  [SOIC-8]
U7  CAT24C32WI-GT3  [ONSC-SOIC-8-751BD-01_M]
U8  SHT14 SENSOR  [XDCR_SHT41-AD1B-R2]
Y1  CRYSTAL 20.0000MHZ 18PF SMD  [4-SMD, NO LEAD CRYSTAL 3.2x2.5mm]  (value not drawn)

### Blocks framed on the sheet
CAN Controller: C32 C36 C37 R27 U5 Y1
CAN Transceiver: C33 C34 R28 U6
CAN Termination Switch: C35 R24-R26 SW1
Power Cycle Switch: Q1 R34
HAT ID EEPROM: C38 R29-R31 TP4 TP5 U7
SHT41 Temp/Humidity Sensor: C39 R32 R33 U8
Power LEDs: D1-D3 R35-R37

### Nets
5V: C34.1 U6.3(VCC)
15V: R35.1
GND: C32.2 C33.2 C34.2 C35.1 C36.2 C37.2 C38.2 C39.2 D1.2 D2.2 D3.2 Q1.2 R28.2 R34.2 SW1.6 TP5.TP U5.7(VSS) U6.2(GND) U7.1(A0) U7.2(A1) U7.3(A2) U7.4(VSS) U8.4(VSS) Y1.2(GND1) Y1.4(GND1)
M2_3V3: R37.1
PI_3V3: C32.1 C33.1 C38.1 C39.1 R24.1 R29.1 R30.1 R31.1 R32.1 R33.1 R36.1 U5.14(VDD) U6.5(VIO) U7.8(VCC) U8.3(VDD)
5V_EN: Q1.3
CAN_INT: U5.4(~{INT})
CANH: SW1.1 U6.7(CANH)
CANL: SW1.4 U6.6(CANL)
CANRX: U5.2(RXCAN) U6.4(RXD)
CANSTB: R27.1 R28.1 U6.8(STB)
CANTX: U5.1(TXCAN) U6.1(TXD)
I2C1_SCL: R33.2 U8.2(SCL)
I2C1_SDA: R32.2 U8.1(SDA)
ID_SCL: R29.2 U7.6(SCL)
ID_SDA: R30.2 U7.5(SDA)
ID_WP: R31.2 TP4.TP U7.7(WP)
PWR_CYCLE: Q1.1 R34.1
SPI_CAN_CS: U5.13(nCS)
SPI_CLK: U5.10(SCK)
SPI_MISO: U5.12(SDO)
SPI_MOSI: U5.11(SDI)
TERM_DET: R24.2 SW1.3 U5.8(~{INT1})
NetC35_2: C35.2 R25.2 R26.2
NetC36_1: C36.1 U5.6(OSC1) Y1.1
NetC37_1: C37.1 U5.5(OSC2) Y1.3
NetD1_1: D1.1 R35.2
NetD2_1: D2.1 R36.2
NetD3_1: D3.1 R37.2
NetR25_1: R25.1 SW1.2
NetR26_1: R26.1 SW1.5
NetR27_2: R27.2 U5.9(~{INT0})

Not connected (* = marked no-connect by the designer): U5 3(CLKO)

### Notes on the sheet
- DWG. NO.
- REV.
- SHT.
- THIS DOCUMENT AND THE DATA DISCLOSED HEREIN OR HEREWITH IS THE PROPERTY OF ALTIUM LIMITED AND MAY BE FREELY DISTRIBUTED IN WHOLE. NO RIGHTS ARE RESERVED OR EXPRESS OR IMPLIED WARANTEE GIVEN.
- REVISION
- DESCRIPTION
- DATE
- APPROVED
- ENG:
- APPROVALS
- PROJECT
- DSN:
- CHK:
- REFERENCE DOCUMENTS
- PROJECT REVISION:
- TITLE
- DOCUMENT REVISION:
- DESIGN ITEM:
- BOM:
- FAB DWG:
- PCB DWG:
- ASSY DWG:
- SCALE:
- SIZE
- B
- CAGE CODE
- FILE NAME
- DWG NO.
- SHEET
- OF
- REV
- (in symbol AO3404A) NMOS
- (in symbol Title_Block) Underwater Robotics Team / Ohio State University; Sheet; of

### Library data of the parts
*#3 = Title_Block: as *#1 on sheet External_Camera_HAT_Connectors
C32-C34 C38 C39 = CAPACITOR_0.1uF_0402: as C3 on sheet External_Camera_HAT_Connectors; Tolerance: +/- 10%; Voltage: 25V; Supplier 1: Digi-Key; Supplier Part Number 1: 478-7868-1-ND
C35 = CAPACITOR_0.0047uF_0402: 4700 pF +/-10% 25V Ceramic Capacitor X7R 0402; Made By: Robert Pafford; Tolerance: +/- 10%; Voltage: 25V; Supplier 1: Digi-Key; Supplier Part Number 1: 478-6195-1-ND
C36 C37 = CAPACITOR_0.000027uF_0402: Cap 27pF 50V +/-5% / Ceramic 0402; Made By: Robert Pafford; Tolerance: +/- 5%; Voltage: 50V; Supplier 1: Digi-Key; Supplier Part Number 1: 445-5589-1-ND
D1-D3 = LED_Green_0603_3.2V: LED Green Vf= 3.2V If = 0.025A / 150060GS75000; Made By: Flip B; Forward Current: 25mA; Supplier 1: Digi-Key; ComponentLink1Description: Datasheet; ComponentLink1URL: https://www.we-online.de/katalog/datasheet/150060GS75000.pdf; Supplier Part Number 1: 732-4971-1-ND; Forward Voltage: 3.2V; Package: 0603
Q1 = AO3404A: N-Channel 30 V 5.8A (Ta) 1.4W (Ta) Surface Mount SOT-23-3; Vendor: Alpha & Omega Semiconductor Inc.; SourceLibrary: ON_Semiconductor_2020-01-13; Vgs (Max): 3V @ 5.8A, 10V; Vgs (th): 3V @ 250µA; Rds (on): 28mOhm @ 5.8A, 10V; Amp Rating: 5.8 A; FET Type: N-Channel; Package: SOT23-3L; Manufacturer _Part_Number: AO3404A; Vdss: 30V; Power Dissipation: 1.4W (Ta); Supplier 1: Digi-Key; Supplier Part Number 1: 785-1004-1-ND; Created By: Dylan T
R24 R28 R34 = RESISTOR_10K_0402: as R6 on sheet External_Camera_HAT_Connectors; Wattage: 1/16W; Supplier: Digikey; Digikey Part Numer: CR0603-JW-104ELFTR-ND; Supplier 1: Digi-Key; Supplier Part Number 1: YAG3436CT-ND
R25 R26 = RESISTOR_60.4_0402: RES 60.4 OHM 1% 1/16W 0402; Tolerance: +/- 1%; Made By: Robert Pafford; Wattage: 1/16W; Supplier: Digikey; Digikey Part Numer: CR0603-JW-104ELFTR-ND; Supplier 1: Digi-Key; Supplier Part Number 1: 13-AC0402FR-0760R4LCT-ND
R27 = RESISTOR_0_0402: as R1 on sheet External_Camera_HAT_Connectors; Wattage: 1/16W; Supplier 1: Digikey; Supplier Part Number 1: 13-AC0402FR-070RLCT-ND
R29 R30 R32 R33 = RESISTOR_3.9K_0402: RES 3.9k OHM 1% 1/16W 0402; Tolerance: +/- 1%; Made By: Robert Pafford; Wattage: 1/16W; Supplier 1: Digikey; Supplier Part Number 1: YAG3484CT-ND
R31 = RESISTOR_1K_0402: RES 1k OHM 1% 1/16W 0402; Tolerance: +/- 1%; Made By: Robert Pafford; Wattage: 1/16W; Supplier: Digikey; Digikey Part Numer: CR0603-JW-104ELFTR-ND; Supplier 1: Digi-Key; Supplier Part Number 1: 13-AC0402FR-131KLCT-ND
R35 = RESISTOR_470K_0603: RES 470k OHM 5% 1/10W 0603; Tolerance: +/- 5%; Made By: Robert P; ComponentLink1Description: Datasheet; ComponentLink1URL: https://www.bourns.com/docs/product-datasheets/CRxxxxx.pdf; Wattage: 1/10W; Supplier 1: Digi-Key; Supplier Part Number 1: RMCF0603JT470KCT-ND
R36 R37 = RESISTOR_4.7K_0603: RES 4.7k OHM 5% 1/10W 0603; Tolerance: +/- 5%; Made By: Robert Pafford; Wattage: 1/10W; Supplier: Digikey; Digikey Part Numer: CR0603-JW-104ELFTR-ND; Supplier 1: Digi-Key; Supplier Part Number 1: RMCF0603JT4K70CT-ND
SW1 = CAS-220TA_CAN_TERM: GOLD SWITCH FLUSH SLIDE DPDT 100MA 6V; Made By: Robert Pafford; Voltage Rating: 6VDC; Current Rating: 100 mA; Switch Function: DPDT; Contact Finish: Gold; Supplier 1: Digi-Key; Supplier Part Number 1: CAS220JCT-ND
TP4 = TESTPOINT: PCB Test Point; Made By: Robert Pafford
TP5 = TESTPOINT: Made By: Robert Pafford
U5 = MCP2517FD: CANbus Controller CAN 2.0 SPI Interface 14-SOIC; Made By: Robert Pafford; Max FD Rate: 8 Mbps
U6 = TJA1442AT: CAN Interface IC High-Speed CAN Transceiver with Standby Mode; Made By: Robert Pafford; Max Data Rate: 5Mbps; Supplier 1: Mouser; Supplier Part Number 1: 771-TJA1442AT/0Z
U7 = CMP-1679-00009-1: I2C CMOS Serial EEPROM, 32 Kb, 1.7 to 5.5 V, -40 to 85 degC, 8-Pin SOIC (751BD), RoHS, Tape and Reel; Case\Package: TO-226-3; hFE Min: 100; Elements: 1; Max Power Dissipation: 625 mW; Frequency: 300 MHz; Vce Max: 1 V; ComponentLink1URL: http://www.onsemi.com/; Mount: Through Hole; REACH SVHC: No SVHC; Packaging: Bulk; Height: 5.33 mm; PackageDescription: 8-Pin Small Outline Integrated Circuit, Body 4.9 x 3.9 mm, Pitch 1.27 mm; ComponentLink2Description: Datasheet; DatasheetVersion: Rev. 24, 06/2015; ComponentLink1Description: Manufacturer URL; PackageReference: SOIC-8-751BD-01; Length: 5.2 mm; ComponentLink2URL: http://www.onsemi.com/pub_link/Collateral/CAT24C32-D.PDF; Pins: 3; Min Operating Temperature: -55 degC; ComponentLink3URL: http://www.onsemi.com/pub_link/Collateral/751BD.PDF; Weight: 0.006314 oz; Max Operating Temperature: 150 degC; Package Quantity: 1000; ComponentLink3Description: Package Specification; Width: 4.19 mm; RoHSCompliant: true; Radiation Hardening: No
U8 = SHT41-AD1B-R2: Digital Relative Humidity Temperature Sensor, Â±1.8 / max 2.5 %RH, Â±0.2 Â°C, Ultra-Low-Power; MF: Sensirion; Price: None; SnapEDA_Link: https://www.snapeda.com/parts/SHT41-AD1B-R2/Sensirion/view-part/?ref=snap; MP: SHT41-AD1B-R2; Purchase-URL: https://pricing.snapeda.com/search/part/SHT41-AD1B-R2/?ref=eda; Value: *; Availability: In Stock; Package: None; Check_prices: https://www.snapeda.com/parts/SHT41-AD1B-R2/Sensirion/view-part/?ref=eda; Supplier 1: Digi-Key; Supplier Part Number 1: 1649-SHT41-AD1B-R2CT-ND
Y1 = CRYSTAL_20MHz_SMD: 20 MHz ±20ppm Crystal 18pF 100 Ohms 4-SMD, No Lead (3.2x2.5mm); Made By: Robert Pafford; Frequency: 20 MHz; ESR: 70 Ohms; Load Capacitance: 18pF; Supplier 1: Digikey; Supplier Part Number 1: 2151-RH100-20.000-18-2020-TRCT-ND

## Sheet External_Camera_HAT_LvlShifters.SchDoc: Sample Sheet Title
size B; Date: MM/DD/YYYY; Author: Sample Author; Organization: ORGANIZATION; Address1: ADDRESS 1; Address2: ADDRESS 2; Address3: ADDRESS 3; Address4: ADDRESS 4; Revision: -; SheetNumber: 4; SheetTotal: 4; ENG_APP_DATE: --/--/--; DSN_APP_DATE: --/--/--; CHK_APP_DATE: --/--/--
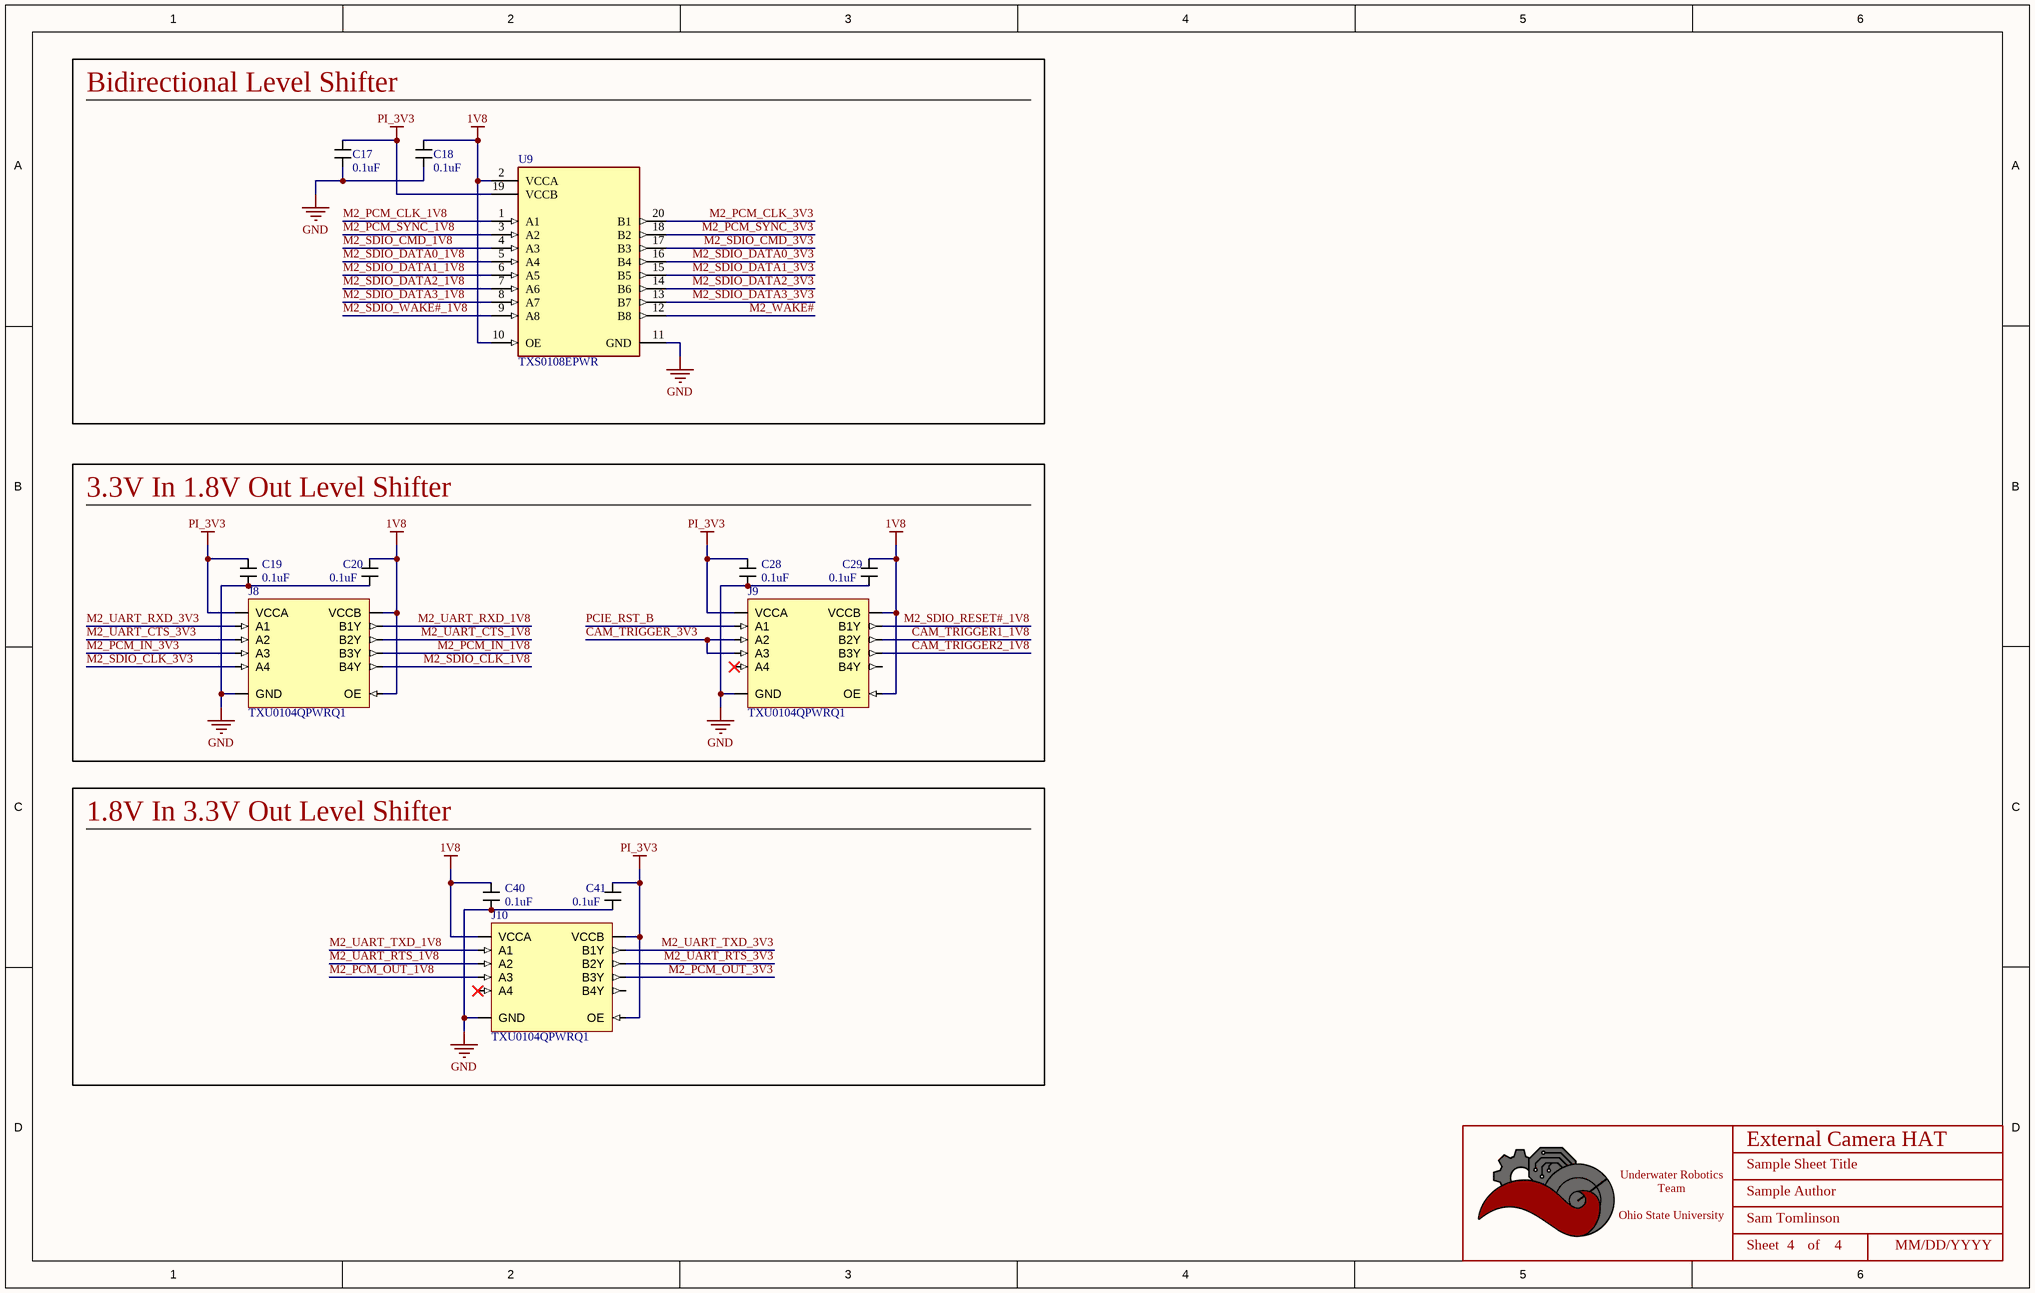
[diagram p3: External_Camera_HAT_LvlShifters.SchDoc]

### Parts
(Parts that share a designator on the sheet are numbered #1, #2 ... from top to bottom, then left to right.)
*#4  Title_Block  [LOGO]  (value not drawn)  (graphical)
C17  value 0.1uF  [CAPACITOR_0402]  (hidden comment: 100nF Ceramic 25V)
C18  value 0.1uF  [CAPACITOR_0402]  (hidden comment: 100nF Ceramic 25V)
C19  value 0.1uF  [CAPACITOR_0402]  (hidden comment: 100nF Ceramic 25V)
C20  value 0.1uF  [CAPACITOR_0402]  (hidden comment: 100nF Ceramic 25V)
C28  value 0.1uF  [CAPACITOR_0402]  (hidden comment: 100nF Ceramic 25V)
C29  value 0.1uF  [CAPACITOR_0402]  (hidden comment: 100nF Ceramic 25V)
C40  value 0.1uF  [CAPACITOR_0402]  (hidden comment: 100nF Ceramic 25V)
C41  value 0.1uF  [CAPACITOR_0402]  (hidden comment: 100nF Ceramic 25V)
J8  TXU0104QPWRQ1  [PW (R-PDSO-G14)]
J9  TXU0104QPWRQ1  [PW (R-PDSO-G14)]
J10  TXU0104QPWRQ1  [PW (R-PDSO-G14)]
U9  TXS0108EPWR  [FP-PW0020A-IPC_C]

### Blocks framed on the sheet
Bidirectional Level Shifter: C17 C18 U9
3.3V In 1.8V Out Level Shifter: C19 C20 C28 C29 J8 J9
1.8V In 3.3V Out Level Shifter: C40 C41 J10

### Nets
1V8: C18.1 C20.1 C29.1 C40.1 J8.8(OE) J8.14(VCCB) J9.8(OE) J9.14(VCCB) J10.1(VCCA) U9.2(VCCA) U9.10(OE)
GND: C17.2 C18.2 C19.2 C20.2 C28.2 C29.2 C40.2 C41.2 J8.7(GND) J9.7(GND) J10.7(GND) U9.11(GND)
PI_3V3: C17.1 C19.1 C28.1 C41.1 J8.1(VCCA) J9.1(VCCA) J10.8(OE) J10.14(VCCB) U9.19(VCCB)
CAM_TRIGGER1_1V8: J9.12(B2Y)
CAM_TRIGGER2_1V8: J9.11(B3Y)
CAM_TRIGGER_3V3: J9.3(A2) J9.4(A3)
M2_PCM_CLK_1V8: U9.1(A1)
M2_PCM_CLK_3V3: U9.20(B1)
M2_PCM_IN_1V8: J8.11(B3Y)
M2_PCM_IN_3V3: J8.4(A3)
M2_PCM_OUT_1V8: J10.4(A3)
M2_PCM_OUT_3V3: J10.11(B3Y)
M2_PCM_SYNC_1V8: U9.3(A2)
M2_PCM_SYNC_3V3: U9.18(B2)
M2_SDIO_CLK_1V8: J8.10(B4Y)
M2_SDIO_CLK_3V3: J8.5(A4)
M2_SDIO_CMD_1V8: U9.4(A3)
M2_SDIO_CMD_3V3: U9.17(B3)
M2_SDIO_DATA0_1V8: U9.5(A4)
M2_SDIO_DATA0_3V3: U9.16(B4)
M2_SDIO_DATA1_1V8: U9.6(A5)
M2_SDIO_DATA1_3V3: U9.15(B5)
M2_SDIO_DATA2_1V8: U9.7(A6)
M2_SDIO_DATA2_3V3: U9.14(B6)
M2_SDIO_DATA3_1V8: U9.8(A7)
M2_SDIO_DATA3_3V3: U9.13(B7)
M2_SDIO_RESET#_1V8: J9.13(B1Y)
M2_SDIO_WAKE#_1V8: U9.9(A8)
M2_UART_CTS_1V8: J8.12(B2Y)
M2_UART_CTS_3V3: J8.3(A2)
M2_UART_RTS_1V8: J10.3(A2)
M2_UART_RTS_3V3: J10.12(B2Y)
M2_UART_RXD_1V8: J8.13(B1Y)
M2_UART_RXD_3V3: J8.2(A1)
M2_UART_TXD_1V8: J10.2(A1)
M2_UART_TXD_3V3: J10.13(B1Y)
M2_WAKE#: U9.12(B8)
PCIE_RST_B: J9.2(A1)

Not connected (* = marked no-connect by the designer): J9 5(A4)* 10(B4Y); J10 5(A4)* 10(B4Y)

### Notes on the sheet
- DWG. NO.
- REV.
- SHT.
- THIS DOCUMENT AND THE DATA DISCLOSED HEREIN OR HEREWITH IS THE PROPERTY OF ALTIUM LIMITED AND MAY BE FREELY DISTRIBUTED IN WHOLE. NO RIGHTS ARE RESERVED OR EXPRESS OR IMPLIED WARANTEE GIVEN.
- REVISION
- DESCRIPTION
- DATE
- APPROVED
- ENG:
- APPROVALS
- PROJECT
- DSN:
- CHK:
- REFERENCE DOCUMENTS
- PROJECT REVISION:
- TITLE
- DOCUMENT REVISION:
- DESIGN ITEM:
- BOM:
- FAB DWG:
- PCB DWG:
- ASSY DWG:
- SCALE:
- SIZE
- B
- CAGE CODE
- FILE NAME
- DWG NO.
- SHEET
- OF
- REV
- (in symbol Title_Block) Underwater Robotics Team / Ohio State University; Sheet; of

### Library data of the parts
*#4 = Title_Block: as *#1 on sheet External_Camera_HAT_Connectors
C17-C20 C28 C29 C40 C41 = CAPACITOR_0.1uF_0402: as C3 on sheet External_Camera_HAT_Connectors; Tolerance: +/- 10%; Voltage: 25V; Supplier 1: Digi-Key; Supplier Part Number 1: 478-7868-1-ND
J8-J10 = TXU0104QPWRQ1: Voltage Level Translator Unidirectional 1 Circuit 4 Channel 200Mbps 14-TSSOP; Made By: Robert Pafford; Voltage Range: 1.1~5.5V; Channels: 4; Channel Type: Unidirectional; Max Rate: 200Mbps; Supplier 1: Digi-Key; Supplier Part Number 1: 296-TXU0104QPWRQ1CT-ND
U9 = CMP-2000-04956-2: IC TRNSLTR BIDIRECTIONAL 20TSSOP; Number of Inputs: 8; Supply Current: 8uA; Low Level Output Current: 50mA; Min Supply Voltage: 1.2V; Quiescent Current: 3uA; Output Type: Voltage; Propagation Delay: 4.8ns; Max Supply Voltage: 5.5V; Output Current: 620uA; Turn-On Delay Time: 312ns; Logic Function: Translator; Data Rate: 60Mbps; Rise Time: 6.3ns; High Level Output Current: -50mA; Number of Pins: 20; Packaging: Tape and Reel; Max Operating Temperature: 85°C; Height: 1.15mm; Nominal Supply Current: 8uA; Termination: SMD/SMT; Lead Free: Lead Free; Package Quantity: 1; Number of Bits: 8; Weight: 0.002716oz; Contact Plating: Gold; Series: -; Width: 4.4mm; Radiation Hardening: No; Mount: Surface Mount; Length: 6.5mm; Case/Package: TSSOP; REACH SVHC: No SVHC; RoHS Compliant: Yes; Min Operating Temperature: -40°C; Number of Channels: 8

## Nets that join several sheets
1V8: External_Camera_HAT_Regulators (C31.1 TP3.TP U4.5), External_Camera_HAT_LvlShifters (11 pins)
5V: External_Camera_HAT_Connectors (J1.02 J1.04), External_Camera_HAT_Regulators (5 pins), External_Camera_HAT_Peripherals (C34.1 U6.3)
15V: External_Camera_HAT_Regulators (16 pins), External_Camera_HAT_Peripherals (R35.1)
GND: External_Camera_HAT_Connectors (48 pins), External_Camera_HAT_Regulators (38 pins), External_Camera_HAT_Peripherals (25 pins), External_Camera_HAT_LvlShifters (12 pins)
M2_3V3: External_Camera_HAT_Connectors (9 pins), External_Camera_HAT_Regulators (5 pins), External_Camera_HAT_Peripherals (R37.1)
PI_3V3: External_Camera_HAT_Connectors (5 pins), External_Camera_HAT_Regulators (C30.1 U4.1 U4.3), External_Camera_HAT_Peripherals (15 pins), External_Camera_HAT_LvlShifters (9 pins)
VIN: External_Camera_HAT_Connectors (J4.3), External_Camera_HAT_Regulators (9 pins)
5V_EN: External_Camera_HAT_Regulators (R13.2 R17.1 U1.12), External_Camera_HAT_Peripherals (Q1.3)
CAM_TRIGGER1_1V8: External_Camera_HAT_Connectors (J5.1), External_Camera_HAT_LvlShifters (J9.12)
CAM_TRIGGER2_1V8: External_Camera_HAT_Connectors (J6.1), External_Camera_HAT_LvlShifters (J9.11)
CAM_TRIGGER_3V3: External_Camera_HAT_Connectors (R2.1 R4.1), External_Camera_HAT_LvlShifters (J9.3 J9.4)
CAN_INT: External_Camera_HAT_Connectors (J1.26), External_Camera_HAT_Peripherals (U5.4)
CANH: External_Camera_HAT_Connectors (J4.4), External_Camera_HAT_Peripherals (SW1.1 U6.7)
CANL: External_Camera_HAT_Connectors (J4.2), External_Camera_HAT_Peripherals (SW1.4 U6.6)
I2C1_SCL: External_Camera_HAT_Connectors (J1.05 J3.60), External_Camera_HAT_Peripherals (R33.2 U8.2)
I2C1_SDA: External_Camera_HAT_Connectors (J1.03 J3.58), External_Camera_HAT_Peripherals (R32.2 U8.1)
ID_SCL: External_Camera_HAT_Connectors (J1.28), External_Camera_HAT_Peripherals (R29.2 U7.6)
ID_SDA: External_Camera_HAT_Connectors (J1.27), External_Camera_HAT_Peripherals (R30.2 U7.5)
M2_PCM_CLK_1V8: External_Camera_HAT_Connectors (J3.8), External_Camera_HAT_LvlShifters (U9.1)
M2_PCM_CLK_3V3: External_Camera_HAT_Connectors (J1.12), External_Camera_HAT_LvlShifters (U9.20)
M2_PCM_IN_1V8: External_Camera_HAT_Connectors (J3.14), External_Camera_HAT_LvlShifters (J8.11)
M2_PCM_IN_3V3: External_Camera_HAT_Connectors (J1.40), External_Camera_HAT_LvlShifters (J8.4)
M2_PCM_OUT_1V8: External_Camera_HAT_Connectors (J3.12), External_Camera_HAT_LvlShifters (J10.4)
M2_PCM_OUT_3V3: External_Camera_HAT_Connectors (J1.38), External_Camera_HAT_LvlShifters (J10.11)
M2_PCM_SYNC_1V8: External_Camera_HAT_Connectors (J3.10), External_Camera_HAT_LvlShifters (U9.3)
M2_PCM_SYNC_3V3: External_Camera_HAT_Connectors (J1.35), External_Camera_HAT_LvlShifters (U9.18)
M2_PWR_EN: External_Camera_HAT_Connectors (R7.2 R8.2), External_Camera_HAT_Regulators (R23.1 U3.12)
M2_SDIO_CLK_1V8: External_Camera_HAT_Connectors (J3.9), External_Camera_HAT_LvlShifters (J8.10)
M2_SDIO_CLK_3V3: External_Camera_HAT_Connectors (J1.15), External_Camera_HAT_LvlShifters (J8.5)
M2_SDIO_CMD_1V8: External_Camera_HAT_Connectors (J3.11), External_Camera_HAT_LvlShifters (U9.4)
M2_SDIO_CMD_3V3: External_Camera_HAT_Connectors (J1.16), External_Camera_HAT_LvlShifters (U9.17)
M2_SDIO_DATA0_1V8: External_Camera_HAT_Connectors (J3.13), External_Camera_HAT_LvlShifters (U9.5)
M2_SDIO_DATA0_3V3: External_Camera_HAT_Connectors (J1.18), External_Camera_HAT_LvlShifters (U9.16)
M2_SDIO_DATA1_1V8: External_Camera_HAT_Connectors (J3.15), External_Camera_HAT_LvlShifters (U9.6)
M2_SDIO_DATA1_3V3: External_Camera_HAT_Connectors (J1.22), External_Camera_HAT_LvlShifters (U9.15)
M2_SDIO_DATA2_1V8: External_Camera_HAT_Connectors (J3.17), External_Camera_HAT_LvlShifters (U9.7)
M2_SDIO_DATA2_3V3: External_Camera_HAT_Connectors (J1.37), External_Camera_HAT_LvlShifters (U9.14)
M2_SDIO_DATA3_1V8: External_Camera_HAT_Connectors (J3.19), External_Camera_HAT_LvlShifters (U9.8)
M2_SDIO_DATA3_3V3: External_Camera_HAT_Connectors (J1.13), External_Camera_HAT_LvlShifters (U9.13)
M2_SDIO_RESET#_1V8: External_Camera_HAT_Connectors (J3.23 R6.1), External_Camera_HAT_LvlShifters (J9.13)
M2_SDIO_WAKE#_1V8: External_Camera_HAT_Connectors (J3.21), External_Camera_HAT_LvlShifters (U9.9)
M2_UART_CTS_1V8: External_Camera_HAT_Connectors (J3.36), External_Camera_HAT_LvlShifters (J8.12)
M2_UART_CTS_3V3: External_Camera_HAT_Connectors (J1.11), External_Camera_HAT_LvlShifters (J8.3)
M2_UART_RTS_1V8: External_Camera_HAT_Connectors (J3.34), External_Camera_HAT_LvlShifters (J10.3)
M2_UART_RTS_3V3: External_Camera_HAT_Connectors (J1.36), External_Camera_HAT_LvlShifters (J10.12)
M2_UART_RXD_1V8: External_Camera_HAT_Connectors (J3.32), External_Camera_HAT_LvlShifters (J8.13)
M2_UART_RXD_3V3: External_Camera_HAT_Connectors (R1.1), External_Camera_HAT_LvlShifters (J8.2)
M2_UART_TXD_1V8: External_Camera_HAT_Connectors (J3.22), External_Camera_HAT_LvlShifters (J10.2)
M2_UART_TXD_3V3: External_Camera_HAT_Connectors (J1.10), External_Camera_HAT_LvlShifters (J10.13)
M2_WAKE#: External_Camera_HAT_Connectors (J1.29 J3.20), External_Camera_HAT_LvlShifters (U9.12)
PCIE_RST_B: External_Camera_HAT_Connectors (J2.1 J3.52), External_Camera_HAT_LvlShifters (J9.2)
PWR_CYCLE: External_Camera_HAT_Connectors (R5.2), External_Camera_HAT_Peripherals (Q1.1 R34.1)
SPI_CAN_CS: External_Camera_HAT_Connectors (J1.24), External_Camera_HAT_Peripherals (U5.13)
SPI_CLK: External_Camera_HAT_Connectors (J1.23), External_Camera_HAT_Peripherals (U5.10)
SPI_MISO: External_Camera_HAT_Connectors (J1.21), External_Camera_HAT_Peripherals (U5.12)
SPI_MOSI: External_Camera_HAT_Connectors (J1.19), External_Camera_HAT_Peripherals (U5.11)

## Assembly variants
Default: not fitted C? C? D? D? R? R? R? R? R? R? R? R? R? R? R? R?